# Altium project Computer_Board.PrjPcb (part 1 of 3)
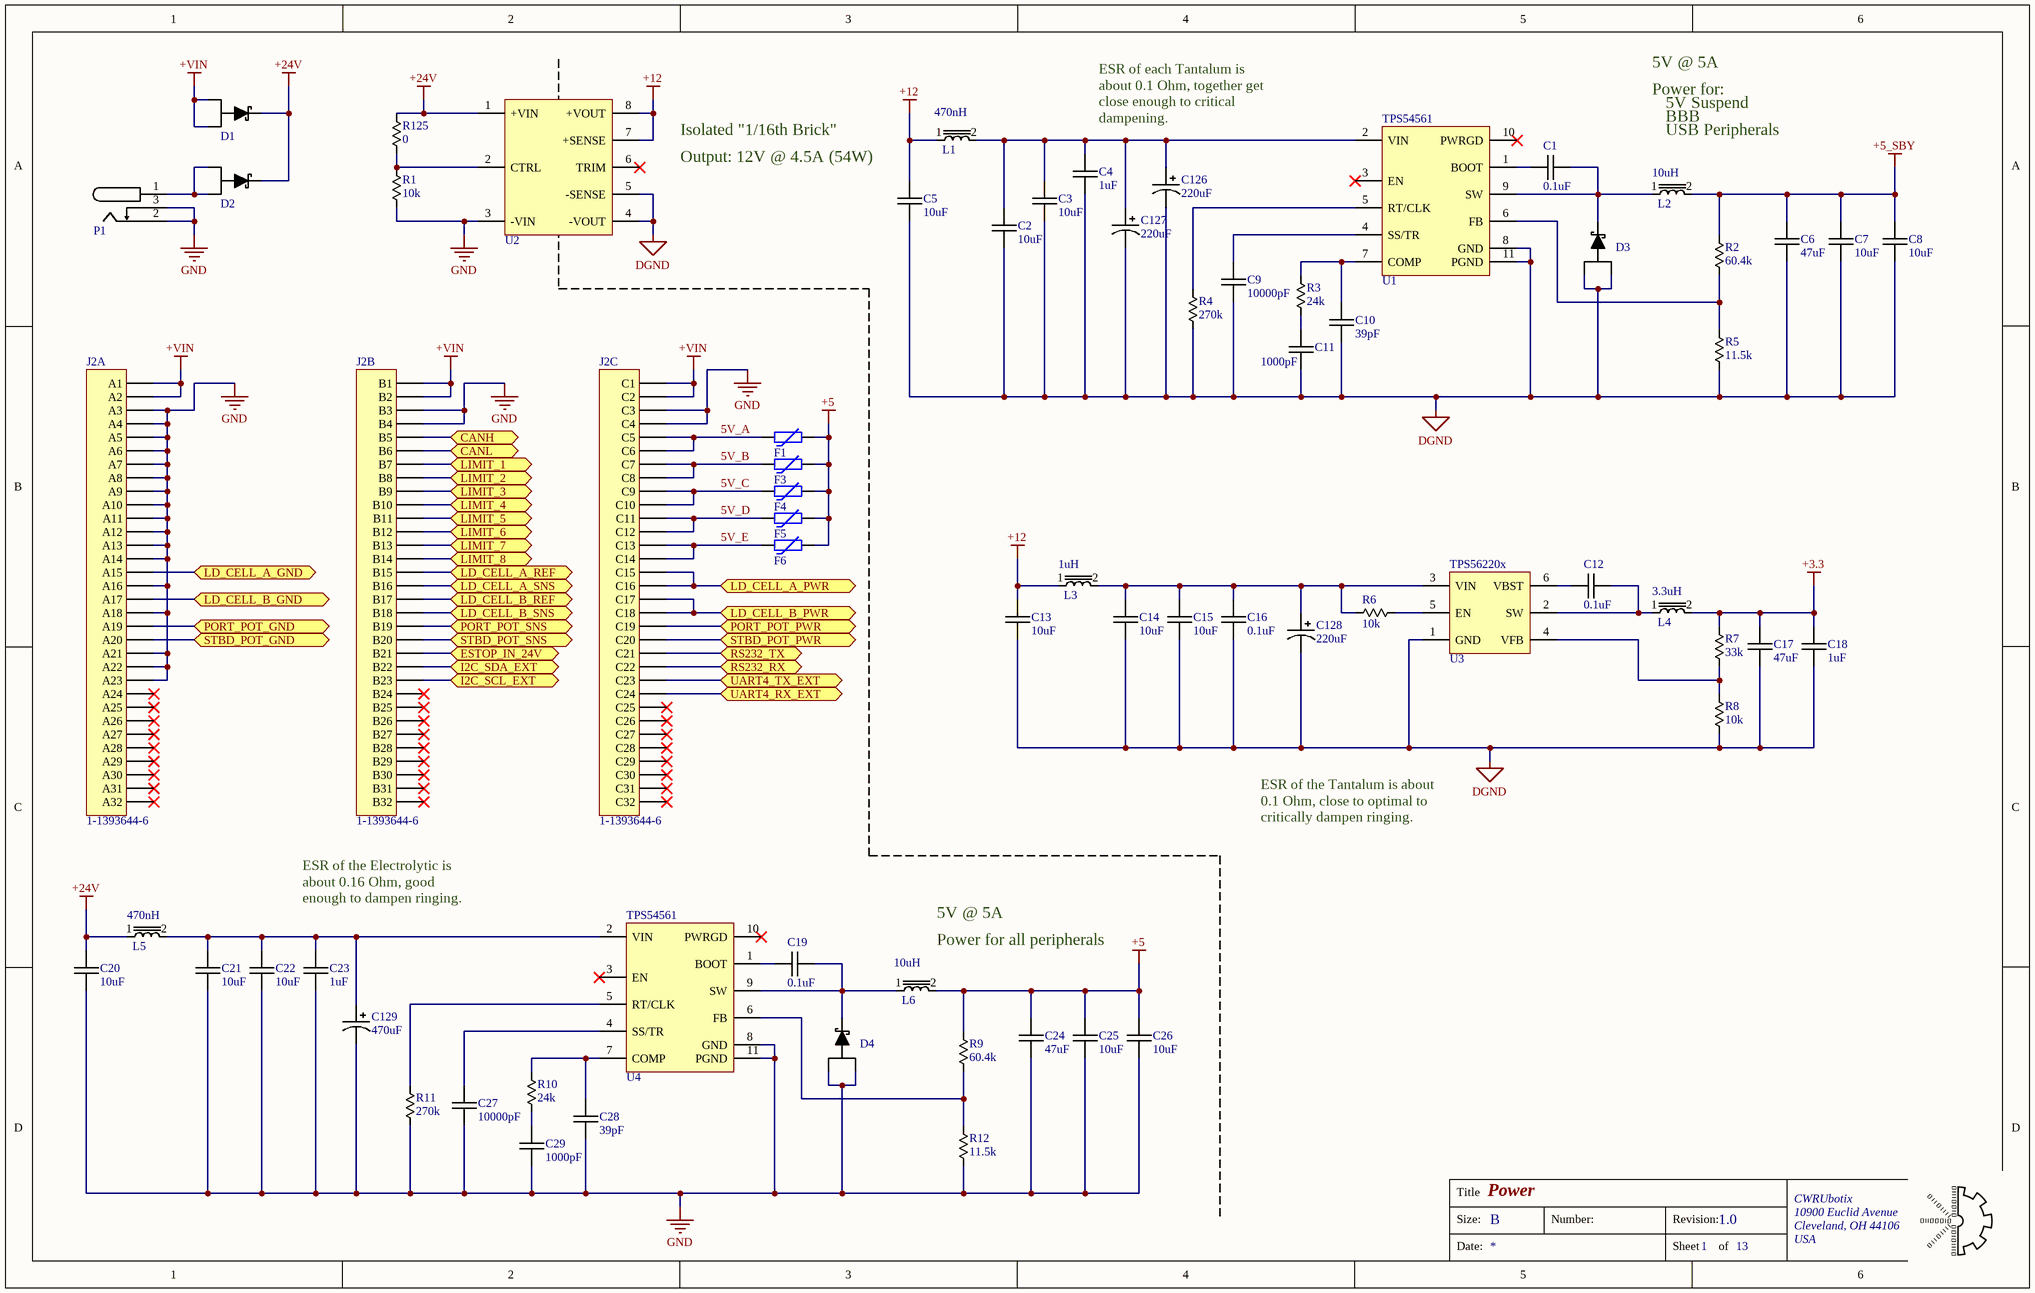
[diagram p0: SCH1_Power.SchDoc]
13 sheets, 443 parts. Net scope: flat (ports and power ports of the same name join across sheets).
Board file: Computer_Board.PcbDoc
Sheets:
  SCH1_Power.SchDoc
  SCH2_Main_Computer.SchDoc
  SCH3_Main_Computer_Eth.SchDoc
  SCH4_Main_Computer_USB.SchDoc
  SCH5_Main_computer_USB2-0.SchDoc
  SCH6_Main_computer_Display.SchDoc
  SCH7_Main_Computer_PCIe.SchDoc
  SCH8_BBB.SchDoc
  SCH9_BBB_Eth.SchDoc
  SCH10_BBB_USB.SchDoc
  SCH11_Digital_IO.SchDoc
  SCH12_AFE.SchDoc
  SCH13_RS232.SchDoc

## Sheet SCH1_Power.SchDoc: Power
size B; Organization: CWRUbotix; Address1: 10900 Euclid Avenue; Address2: Cleveland, OH 44106; Address3: USA; Revision: 1.0; SheetNumber: 1; SheetTotal: 13

### Parts
C1  0.1uF  [chip_0603]
C2  10uF  [chip_1206]
C3  10uF  [chip_1206]
C4  1uF  [chip_0805]
C5  10uF  [chip_1206]
C6  47uF  [chip_1210]
C7  10uF  [chip_1206]
C8  10uF  [chip_1206]
C9  10000pF  [chip_0603]
C10  39pF  [chip_0603]
C11  1000pF  [chip_0603]
C12  0.1uF  [chip_0603]
C13  10uF  [chip_1206]
C14  10uF  [chip_1206]
C15  10uF  [chip_1206]
C16  0.1uF  [chip_0603]
C17  47uF  [chip_1210]
C18  1uF  [chip_0805]
C19  0.1uF  [chip_0603]
C20  10uF  [chip_1206]
C21  10uF  [chip_1206]
C22  10uF  [chip_1206]
C23  1uF  [chip_0805]
C24  47uF  [chip_1210]
C25  10uF  [chip_1206]
C26  10uF  [chip_1206]
C27  10000pF  [chip_0603]
C28  39pF  [chip_0603]
C29  1000pF  [chip_0603]
C126  220uF  [chip_2917_KEMET_T495]
C127  220uF  [chip_2917_KEMET_T495]
C128  220uF  [chip_2917_KEMET_T495]
C129  470uF  [CAP_SMD_10x10_0]
D1  diode_sch_A12C3  [TO-277-3]  (value not drawn)
D2  diode_sch_A12C3  [TO-277-3]  (value not drawn)
D3  diode_sch_A12C3  [TO-277-3]  (value not drawn)
D4  diode_sch_A12C3  [TO-277-3]  (value not drawn)
F1  PTC_0  [chip_1206]  (value not drawn)
F3  PTC_0  [chip_1206]  (value not drawn)
F4  PTC_0  [chip_1206]  (value not drawn)
F5  PTC_0  [chip_1206]  (value not drawn)
F6  PTC_0  [chip_1206]  (value not drawn)
J2  1-1393644-6  [TE_CONN_1-1393644-6]  (parts A,B,C of 3)
L1  Inductance: 470nH  [CHIP_1008_IND]  (hidden comment: ind_1)
L2  Inductance: 10uH  [VISHAY_IHLP3232DZ]  (hidden comment: ind_1)
L3  Inductance: 1uH  [chip_0805]  (hidden comment: ind_1)
L4  Inductance: 3.3uH  [BOURNS_SRN5040]  (hidden comment: ind_1)
L5  Inductance: 470nH  [CHIP_1008_IND]  (hidden comment: ind_1)
L6  Inductance: 10uH  [VISHAY_IHLP3232DZ]  (hidden comment: ind_1)
P1  conn-barrel_0  [SWITCHCRAFT_RAPC722X]  (value not drawn)
R1  10k  [chip_0603]
R2  60.4k  [chip_0805]
R3  24k  [chip_0603]
R4  270k  [chip_0603]
R5  11.5k  [chip_0805]
R6  10k  [chip_0603]
R7  33k  [chip_0603]
R8  10k  [chip_0603]
R9  60.4k  [chip_0805]
R10  24k  [chip_0603]
R11  270k  [chip_0603]
R12  11.5k  [chip_0805]
R125  0  [chip_0805]
U1  TPS54561  [WSON-10_0]
U2  UWS-12/4.5-Q48N-C  [MURATA_UWS]  (value not drawn)
U3  TPS56220x  [sot-23-6]
U4  TPS54561  [WSON-10_0]

### Ports
CANH (bidir), CANL (bidir), ESTOP_IN_24V (bidir), I2C_SCL_EXT (bidir), I2C_SDA_EXT (bidir), LD_CELL_A_GND (bidir), LD_CELL_A_PWR (bidir), LD_CELL_A_REF (bidir), LD_CELL_A_SNS (bidir), LD_CELL_B_GND (bidir), LD_CELL_B_PWR (bidir), LD_CELL_B_REF (bidir), LD_CELL_B_SNS (bidir), LIMIT_1 (bidir), LIMIT_2 (bidir), LIMIT_3 (bidir), LIMIT_4 (bidir), LIMIT_5 (bidir), LIMIT_6 (bidir), LIMIT_7 (bidir), LIMIT_8 (bidir), PORT_POT_GND (bidir), PORT_POT_PWR (bidir), PORT_POT_SNS (bidir), RS232_RX (bidir), RS232_TX (bidir), STBD_POT_GND (bidir), STBD_POT_PWR (bidir), STBD_POT_SNS (bidir), UART4_RX_EXT (bidir), UART4_TX_EXT (bidir)

### Nets
+3.3: C17.1 C18.1 L4.2 R7.1
+5: C24.1 C25.1 C26.1 F1.2 F3.2 F4.2 F5.2 F6.2 L6.2 R9.1
+5_SBY: C6.1 C7.1 C8.1 L2.2 R2.1
+12: C5.1 C13.1 L1.1 L3.1 U2.7(+SENSE) U2.8(+VOUT)
+24V: C20.1 D1.3 D2.3 L5.1 R125.2 U2.1(+VIN)
+VIN: D1.1 D1.2 J2.A1 J2.A2 J2.B1 J2.B2 J2.C1 J2.C2
DGND: C2.2 C3.2 C4.2 C5.2 C6.2 C7.2 C8.2 C9.2 C10.2 C11.2 C13.2 C14.2 C15.2 C16.2 C17.2 C18.2 C126.2 C127.2 C128.2 D3.1 D3.2 R4.2 R5.2 R8.2 U1.8(GND) U1.11(PGND) U2.4(-VOUT) U2.5(-SENSE) U3.1(GND)
GND: C20.2 C21.2 C22.2 C23.2 C24.2 C25.2 C26.2 C27.2 C28.2 C29.2 C129.2 D4.1 D4.2 J2.A3 J2.A4 J2.A5 J2.A6 J2.A7 J2.A8 J2.A9 J2.A10 J2.A11 J2.A12 J2.A13 J2.A14 J2.A16 J2.A18 J2.A21 J2.A22 J2.A23 J2.B3 J2.B4 J2.C3 J2.C4 P1.2(GND) P1.3 R1.2 R11.2 R12.2 U2.3(-VIN) U4.8(GND) U4.11(PGND)
5V_A: F1.1 J2.C5 J2.C6
5V_B: F3.1 J2.C7 J2.C8
5V_C: F4.1 J2.C9 J2.C10
5V_D: F5.1 J2.C11 J2.C12
5V_E: F6.1 J2.C13 J2.C14
CANH: J2.B5 ; port CANH
CANL: J2.B6 ; port CANL
ESTOP_IN_24V: J2.B21 ; port ESTOP_IN_24V
I2C_SCL_EXT: J2.B23 ; port I2C_SCL_EXT
I2C_SDA_EXT: J2.B22 ; port I2C_SDA_EXT
LD_CELL_A_GND: J2.A15 ; port LD_CELL_A_GND
LD_CELL_A_PWR: J2.C15 J2.C16 ; port LD_CELL_A_PWR
LD_CELL_A_REF: J2.B15 ; port LD_CELL_A_REF
LD_CELL_A_SNS: J2.B16 ; port LD_CELL_A_SNS
LD_CELL_B_GND: J2.A17 ; port LD_CELL_B_GND
LD_CELL_B_PWR: J2.C17 J2.C18 ; port LD_CELL_B_PWR
LD_CELL_B_REF: J2.B17 ; port LD_CELL_B_REF
LD_CELL_B_SNS: J2.B18 ; port LD_CELL_B_SNS
LIMIT_1: J2.B7 ; port LIMIT_1
LIMIT_2: J2.B8 ; port LIMIT_2
LIMIT_3: J2.B9 ; port LIMIT_3
LIMIT_4: J2.B10 ; port LIMIT_4
LIMIT_5: J2.B11 ; port LIMIT_5
LIMIT_6: J2.B12 ; port LIMIT_6
LIMIT_7: J2.B13 ; port LIMIT_7
LIMIT_8: J2.B14 ; port LIMIT_8
PORT_POT_GND: J2.A19 ; port PORT_POT_GND
PORT_POT_PWR: J2.C19 ; port PORT_POT_PWR
PORT_POT_SNS: J2.B19 ; port PORT_POT_SNS
RS232_RX: J2.C22 ; port RS232_RX
RS232_TX: J2.C21 ; port RS232_TX
STBD_POT_GND: J2.A20 ; port STBD_POT_GND
STBD_POT_PWR: J2.C20 ; port STBD_POT_PWR
STBD_POT_SNS: J2.B20 ; port STBD_POT_SNS
UART4_RX_EXT: J2.C24 ; port UART4_RX_EXT
UART4_TX_EXT: J2.C23 ; port UART4_TX_EXT
NetC1_1: C1.1 U1.1(BOOT)
NetC1_2: C1.2 D3.3 L2.1 U1.9(SW)
NetC2_1: C2.1 C3.1 C4.1 C126.1 C127.1 L1.2 U1.2(VIN)
NetC9_1: C9.1 U1.4(SS/TR)
NetC10_1: C10.1 R3.1 U1.7(COMP)
NetC11_1: C11.1 R3.2
NetC12_1: C12.1 U3.6(VBST)
NetC12_2: C12.2 L4.1 U3.2(SW)
NetC14_1: C14.1 C15.1 C16.1 C128.1 L3.2 R6.2 U3.3(VIN)
NetC19_1: C19.1 U4.1(BOOT)
NetC19_2: C19.2 D4.3 L6.1 U4.9(SW)
NetC21_1: C21.1 C22.1 C23.1 C129.1 L5.2 U4.2(VIN)
NetC27_1: C27.1 U4.4(SS/TR)
NetC28_1: C28.1 R10.1 U4.7(COMP)
NetC29_1: C29.1 R10.2
NetD2_1: D2.1 D2.2 P1.1(VCC)
NetR1_1: R1.1 R125.1 U2.2(CTRL)
NetR2_2: R2.2 R5.1 U1.6(FB)
NetR4_1: R4.1 U1.5(RT/CLK)
NetR6_1: R6.1 U3.5(EN)
NetR7_2: R7.2 R8.1 U3.4(VFB)
NetR9_2: R9.2 R12.1 U4.6(FB)
NetR11_1: R11.1 U4.5(RT/CLK)

Not connected (* = marked no-connect by the designer): J2 A24* A25* A26* A27* A28* A29* A30* A31* A32* B24* B25* B26* B27* B28* B29* B30* B31* B32* C25* C26* C27* C28* C29* C30* C31* C32*; U1 3(EN)* 10(PWRGD)*; U2 6(TRIM)*; U4 3(EN)* 10(PWRGD)*

### Notes on the sheet
- 5V @ 5A
- Power for:
- Isolated "1/16th Brick"
- (near C5) Output: 12V @ 4.5A (54W)
- ESR of each Tantalum is about 0.1 Ohm, together get close enough to critical dampening.
- 5V Suspend
- BBB
- USB Peripherals
- ESR of the Tantalum is about 0.1 Ohm, close to optimal to critically dampen ringing.
- ESR of the Electrolytic is about 0.16 Ohm, good enough to dampen ringing.
- (near L6) Power for all peripherals
- Title
- Size:
- B
- Number:
- Revision:
- Date:
- Sheet
- of

### Library data of the parts
C1 C12 C16 C19 = CAP-00542: CAP, 0.1uF, ±10%, 16V, X7R, 0603; Manufacturer: Murata; Part Number: CAP-00542; Capacitance: 0.1uF; Tolerance: ±10%; Voltage Rating: 16V; Type: X7R
C2 C3 C5 C7 C8 C13-C15 C20-C22 C25 C26 = CAP-00539: CAP, 10uF, ±10%, 25V, X7R, 1206; Manufacturer: Samsung; Manufacturer PN: CL31B106KAHNNNE; Part Number: CAP-00539; Capacitance: 10uF; Tolerance: ±10%; Voltage Rating: 25V; Type: X7R
C4 C18 C23 = CAP-00110: CAP, 1uF, 10%, 16V, X7R, 0805; Manufacturer: Murata; Manufacturer PN: GRM21BR71C105KA01K; Part Number: CAP-00110; Capacitance: 1uF; Tolerance: 10%; Voltage Rating: 16V; Type: X7R
C6 C17 C24 = CAP-00557: CAP, 47uF, ±20%, 6.3V, X7R, 1210; Manufacturer: KEMET; Manufacturer PN: C1210C476M9RACTU; Part Number: CAP-00557; Capacitance: 47uF; Tolerance: ±20%; Voltage Rating: 6.3V; Type: X7R; Cost: $1.08
C9 C27 = CAP-00543: CAP, 10000pF, ±10%, 16V, X7R, 0603; Part Number: CAP-00543; Capacitance: 10000pF; Tolerance: ±10%; Voltage Rating: 16V; Type: X7R
C10 C28 = CAP-00423: CAP, 39pF, ±1%, 50V, C0G, 0603; Manufacturer: Murata; Manufacturer PN: GRM1885C1H390FA01D; Part Number: CAP-00423; Capacitance: 39pF; Tolerance: ±1%; Voltage Rating: 50V; Type: C0G
C11 C29 = CAP-00457: CAP, 1000pF, ±1%, 50V, C0G, 0603; Manufacturer: Murata; Manufacturer PN: GRM1885C1H102FA01D; Part Number: CAP-00457; Capacitance: 1000pF; Tolerance: ±1%; Voltage Rating: 50V; Type: C0G
C126-C128 = CAP-00584: CAP, 220uF, ±10%, 16V, Tantalum, 100mOhm, 2917; Manufacturer: KEMET; Manufacturer PN: T495X227K016ATE100; Part Number: CAP-00584; Capacitance: 220uF; Tolerance: ±10%; Voltage Rating: 16V; Type: Tantalum; Cost: $2.57
C129 = CAP-00558: CAP, 470uF, ±20%, 25V, Al, SMD, 7000hrs at 105°C; Manufacturer: Nichicon; Manufacturer PN: UCW1E471MNL1GS; Part Number: CAP-00558; Capacitance: 470uF; Tolerance: ±20%; Voltage Rating: 25V; Type: Al; Cost: $0.70
D1-D4 = DIO-00074: Dio, Schottky, 5A, 0.63V, 60V, TO-227; Manufacturer: Vishay; Manufacturer PN: SS5P6-M3/86A; Part Number: DIO-00074; Forward Voltage: 0.63V; Reverse Breakdown Voltage: 60V; Current Rating: 5A; Type: Schottky; Cost: 0.6
F1 F3-F6 = MISC-00008: PTC Resettable fuse, 6V, 500mA, 1206; Manufacturer: Eaton; Manufacturer PN: PTS12066V050; Part Number: MISC-00008; Cost: 0.3
J2 = CONN-00084: DIN 41612 Plug, 96-Pos, Male Pins, Right-Angle; Manufacturer: TE Connectivity; Positions per level: 32; Levels: 3; Part Number: CONN-00084; Type: Plug; Manufacturer PN: 1-1393644-6; Cost: 7.49
L1 L5 = MAG-00124: Ind, 470nH, 4A, 0.027 Ohm, 1008; Manufacturer: Murata; Manufacturer PN: DFE252012P-R47M=P2; Tolerance: 20%; Test Freq: 1MHz; DCR: 27mOhm; Part Number: MAG-00124; Current Rating: 4A; Cost: 0.51
L2 L6 = MAG-00106: Ind, 10uH, 20%, 5.2A (9A sat.), 0.0599 Ohm; Manufacturer: Vishay Dale; Manufacturer PN: IHLP3232DZER100M01; DCR: 59.9mOhm; Part Number: MAG-00106; Tolerance: 20%; Current Rating: 5.2A; Cost: 1.65
L3 = MAG-00019: Ind, 1uH, 20%, 900mA, 0805; Manufacturer: TDK; Manufacturer PN: MLZ2012A1R0WTD25; DCR: 130 mOhm; Part Number: MAG-00019; Tolerance: 20%; Current Rating: 900mA
L4 = MAG-00111: Ind, 3.3uH, 3.3A (3.8A sat.), 0.027 Ohm; Manufacturer: Bourns; Manufacturer PN: SRN5040-3R3M; Tolerance: 20%; DCR: 27mOhm; Part Number: MAG-00111; Current Rating: 3.3A; Cost: 0.46
P1 = CONN-00074: Barrel Jack, 2.0x5.5mm IDxOD, Right-Angle; Manufacturer: Switchcraft; Manufacturer PN: RAPC722X; Positions per level: 3; Levels: 1; Part Number: CONN-00074; Type: Barrel Jack; Cost: 1.64
R1 R6 R8 = RES-00306: RES SMD 10K OHM 1% 1/4W 0603; Manufacturer: Panasonic; Manufacturer PN: ERJ-PA3F1002V; Power Rating: 0.25W; Part Number: RES-00306; Resistance: 10k; Tolerance: 1%; Cost: 0.144
R2 R9 = RES-00531: RES SMD 60.4K OHM 1% 1/8W 0805; Manufacturer: Rohm Semiconductor; Manufacturer PN: KTR10EZPF6042; Power Rating: 0.125W; Part Number: RES-00531; Resistance: 60.4k; Tolerance: 1%
R3 R10 = RES-00399: RES SMD 24K OHM 1% 1/4W 0603; Manufacturer: Panasonic; Manufacturer PN: ERJ-PA3F2402V; Power Rating: 0.25W; Part Number: RES-00399; Resistance: 24k; Tolerance: 1%
R4 R11 = RES-00405: RES SMD 270K OHM 1% 1/4W 0603; Manufacturer: Panasonic; Manufacturer PN: ERJ-PA3F2703V; Power Rating: 0.25W; Part Number: RES-00405; Resistance: 270k; Tolerance: 1%
R5 R12 = RES-00309: RES SMD 11.5K OHM 1% 1/8W 0805; Manufacturer: Rohm Semiconductor; Manufacturer PN: KTR10EZPF1152; Power Rating: 0.125W; Part Number: RES-00309; Resistance: 11.5k; Tolerance: 1%
R7 = RES-00442: RES SMD 33K OHM 1% 1/4W 0603; Manufacturer: Panasonic; Manufacturer PN: ERJ-PA3F3302V; Power Rating: 0.25W; Part Number: RES-00442; Resistance: 33k; Tolerance: 1%
R125 = RES-00720: RES SMD 0 OHM 1/8W 0805 Thick Film; Manufacturer: Stackpole; Manufacturer PN: RMCF0805ZT0R00; Tolerance: Jumper; Part Number: RES-00720; Resistance: 0; Power Rating: 1/8W; Cost: 0.1
U1 U4 = PWREG-00033: REG, SW Buck Adj, 5A, 4.5-60V, 2.5MHz, TPS54561; Manufacturer: TI; Manufacturer PN: TPS54561DPRR; Voltage Range Out: 0.8-58.8V; Frequency: 100kHz-2.5MHz; Reg Type: SW Buck; Part Number: PWREG-00033; Voltage Range In: 4.5-60V; Max Current: 5A; Fixed/Adj: Adj; Cost: 5.52
U2 = PWREG-00058: Module, Isolated, 1/16 Brick, 12V 4.5A (54W) Negative Logic; Manufacturer: Murata; Voltage Range In: 18 ~ 75V; Reg Type: Isolated Module; Fixed/Adj: Fixed; Part Number: PWREG-00058; Voltage Range Out: 12V; Max Current: 4.5A; Manufacturer PN: UWS-12/4.5-Q48N-C; Cost: 32
U3 = PWREG-00040: REG, Synchronous Buck, 2A, 4.5-17V Input, SOT-23-6, TPS562201; Manufacturer: TI; Manufacturer PN: TPS562201DDCR; Voltage Range Out: 0.76 - 7V; Frequency: 580kHz; Reg Type: SW Buck; Fixed/Adj: Adj; Part Number: PWREG-00040; Voltage Range In: 4.5 - 17V; Max Current: 2A; Cost: 0.68

## Sheet SCH2_Main_Computer.SchDoc: Main Computer
size B; Organization: CWRUbotix; Address1: 10900 Euclid Avenue; Address2: Cleveland, OH 44106; Address3: USA; Revision: 1.0; SheetNumber: 2; SheetTotal: 13
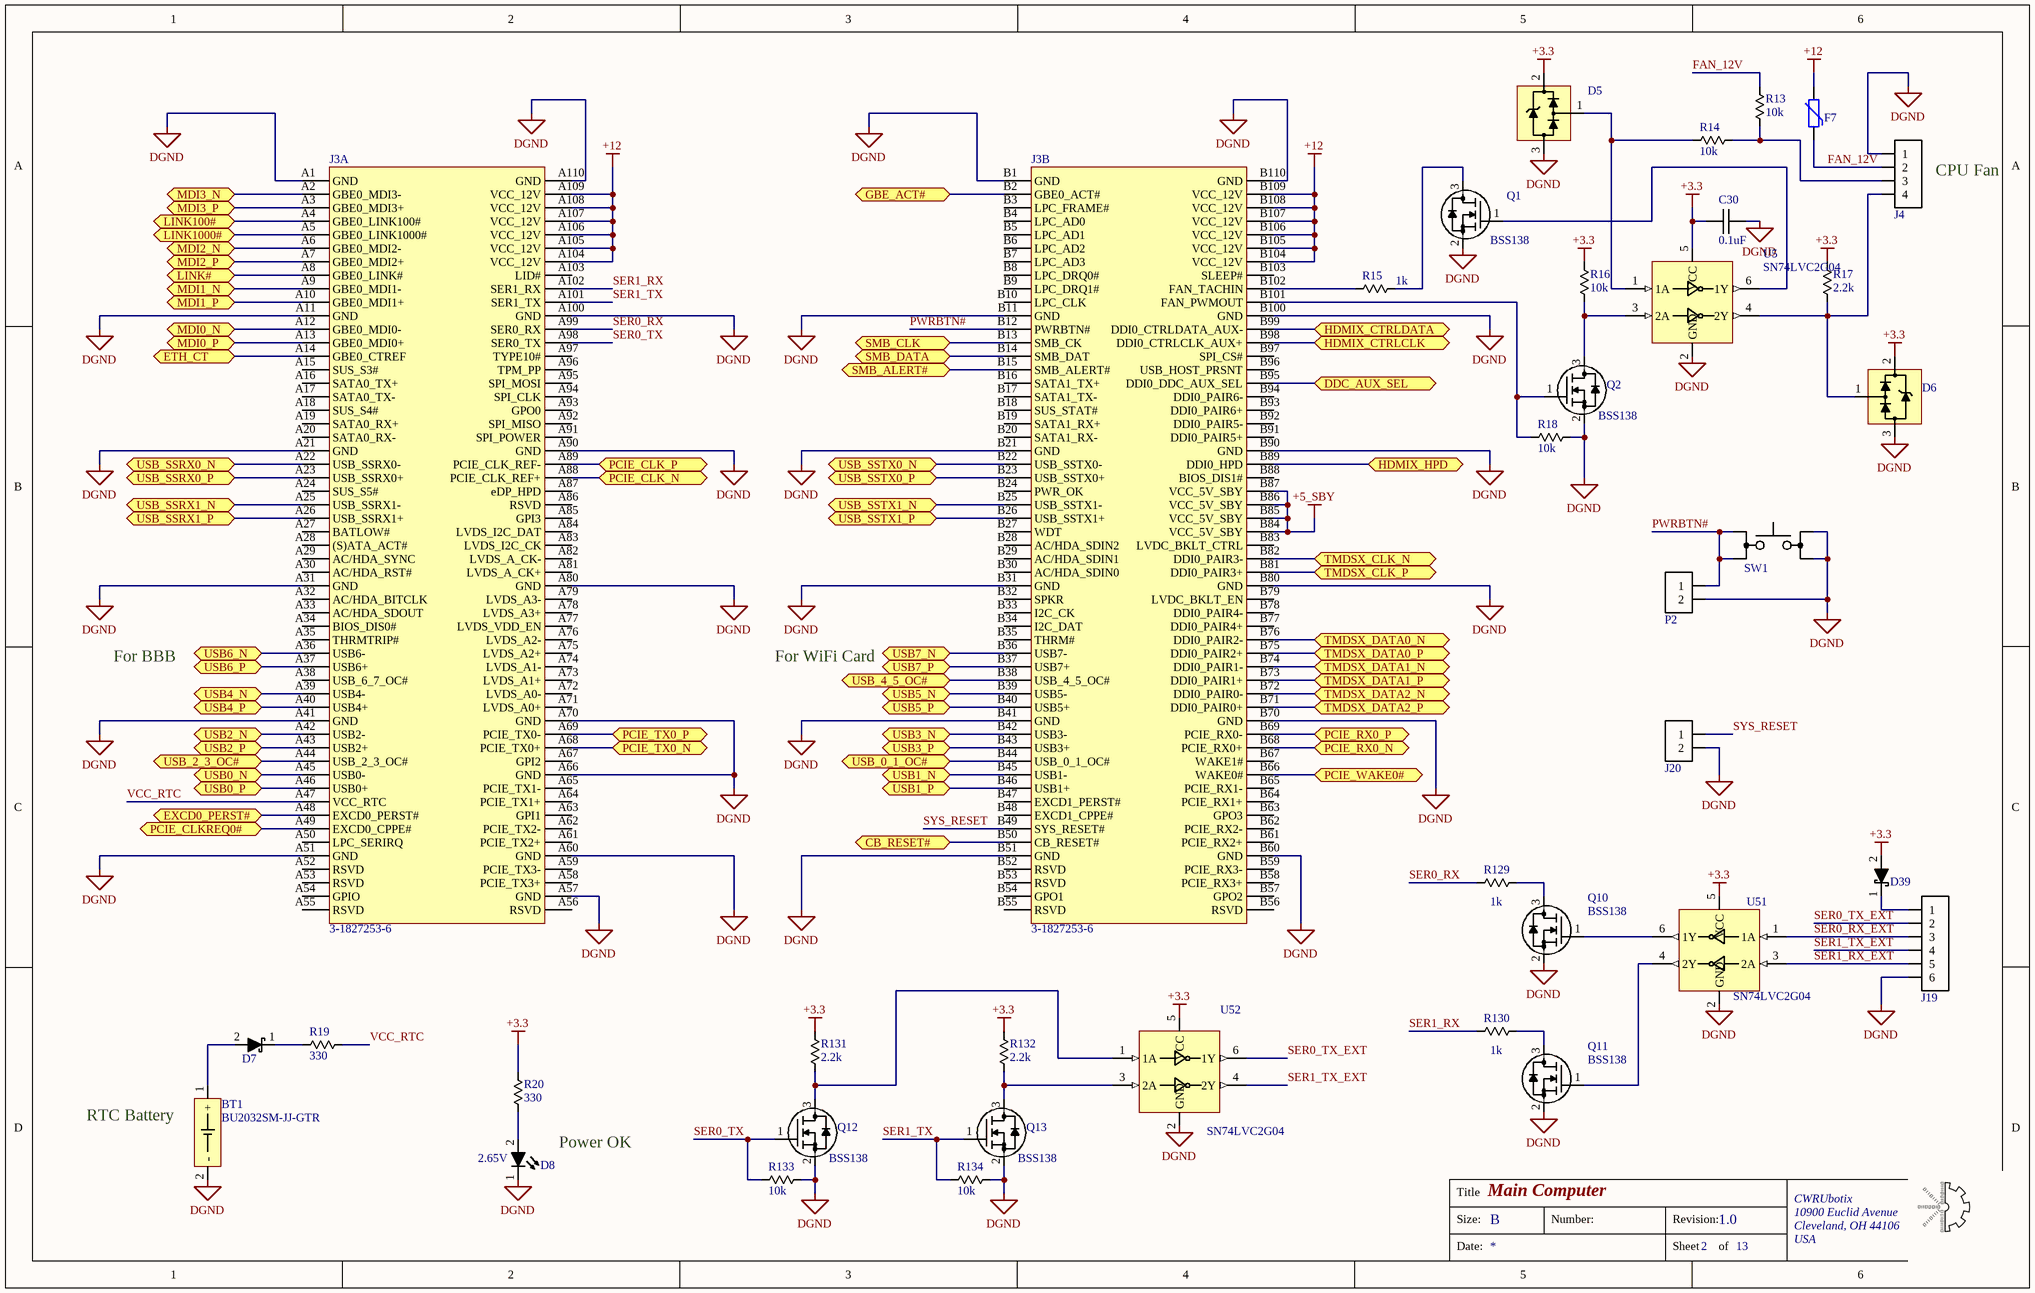
[diagram p1: SCH2_Main_Computer.SchDoc]

### Parts
BT1  BU2032SM-JJ-GTR  [BU2032SM-JJ-GTR]
C30  0.1uF  [chip_0603]
D5  DLPT05  [sot-23-3]  (value not drawn)
D6  DLPT05  [sot-23-3]  (value not drawn)
D7  diode_2  [sod123_0]  (value not drawn)
D8  Forward Voltage: 2.65V  [chip_0603_LED]  (hidden comment: diode_4)
D39  diode_2  [sod123_0]  (value not drawn)
F7  PTC_0  [chip_1210]  (value not drawn)
J3  3-1827253-6  [TE_CONN_1827253]  (parts A,B of 2)
J4  conn-4x1_0  [MOLEX_0470531000]  (value not drawn)
J19  conn-6x1_0  [HDDR_6X1_0]  (value not drawn)
J20  conn-2x1_0  [HDDR_2x1_0]  (value not drawn)
P2  conn-2x1_0  [HDDR_2x1_0]  (value not drawn)
Q1  Manufacturer PN: BSS138  [sot-23-3]  (hidden comment: n-mosfet_1)
Q2  Manufacturer PN: BSS138  [sot-23-3]  (hidden comment: n-mosfet_1)
Q10  Manufacturer PN: BSS138  [sot-23-3]  (hidden comment: n-mosfet_1)
Q11  Manufacturer PN: BSS138  [sot-23-3]  (hidden comment: n-mosfet_1)
Q12  Manufacturer PN: BSS138  [sot-23-3]  (hidden comment: n-mosfet_1)
Q13  Manufacturer PN: BSS138  [sot-23-3]  (hidden comment: n-mosfet_1)
R13  10k  [chip_0603]
R14  10k  [chip_0603]
R15  1k  [chip_0603]
R16  10k  [chip_0603]
R17  2.2k  [chip_0603]
R18  10k  [chip_0603]
R19  330  [chip_0603]
R20  330  [chip_0603]
R129  1k  [chip_0603]
R130  1k  [chip_0603]
R131  2.2k  [chip_0603]
R132  2.2k  [chip_0603]
R133  10k  [chip_0603]
R134  10k  [chip_0603]
SW1  SW_1P1T_2  [B3FS-1000]  (value not drawn)
U5  SN74LVC2G04  [sot-23-6]
U51  SN74LVC2G04  [sot-23-6]
U52  SN74LVC2G04  [sot-23-6]

### Ports
CB_RESET# (bidir), DDC_AUX_SEL (bidir), ETH_CT (bidir), EXCD0_PERST# (bidir), GBE_ACT# (bidir), HDMIX_CTRLCLK (bidir), HDMIX_CTRLDATA (bidir), HDMIX_HPD (bidir), LINK100# (bidir), LINK1000# (bidir), LINK# (bidir), MDI0_N (bidir), MDI0_P (bidir), MDI1_N (bidir), MDI1_P (bidir), MDI2_N (bidir), MDI2_P (bidir), MDI3_N (bidir), MDI3_P (bidir), PCIE_CLK_N (bidir), PCIE_CLK_P (bidir), PCIE_CLKREQ0# (bidir), PCIE_RX0_N (bidir), PCIE_RX0_P (bidir), PCIE_TX0_N (bidir), PCIE_TX0_P (bidir), PCIE_WAKE0# (bidir), SMB_ALERT# (bidir), SMB_CLK (bidir), SMB_DATA (bidir), TMDSX_CLK_N (bidir), TMDSX_CLK_P (bidir), TMDSX_DATA0_N (bidir), TMDSX_DATA0_P (bidir), TMDSX_DATA1_N (bidir), TMDSX_DATA1_P (bidir), TMDSX_DATA2_N (bidir), TMDSX_DATA2_P (bidir), USB0_N (bidir), USB0_P (bidir), USB1_N (bidir), USB1_P (bidir), USB2_N (bidir), USB2_P (bidir), USB3_N (bidir), USB3_P (bidir), USB4_N (bidir), USB4_P (bidir), USB5_N (bidir), USB5_P (bidir), USB6_N (bidir), USB6_P (bidir), USB7_N (bidir), USB7_P (bidir), USB_0_1_OC# (bidir), USB_2_3_OC# (bidir), USB_4_5_OC# (bidir), USB_SSRX0_N (bidir), USB_SSRX0_P (bidir), USB_SSRX1_N (bidir), USB_SSRX1_P (bidir), USB_SSTX0_N (bidir), USB_SSTX0_P (bidir), USB_SSTX1_N (bidir), USB_SSTX1_P (bidir)

### Nets
+3.3: C30.1 D5.2(VCC) D6.2(VCC) D39.2 R16.1 R17.1 R20.2 R131.1 R132.1 U5.5(VCC) U51.5(VCC) U52.5(VCC)
+5_SBY: J3.B84(VCC_5V_SBY) J3.B85(VCC_5V_SBY) J3.B86(VCC_5V_SBY) J3.B87(VCC_5V_SBY)
+12: F7.2 J3.A104(VCC_12V) J3.A105(VCC_12V) J3.A106(VCC_12V) J3.A107(VCC_12V) J3.A108(VCC_12V) J3.A109(VCC_12V) J3.B104(VCC_12V) J3.B105(VCC_12V) J3.B106(VCC_12V) J3.B107(VCC_12V) J3.B108(VCC_12V) J3.B109(VCC_12V)
DGND: BT1.2(-) C30.2 D5.3(GND) D6.3(GND) D8.1 J3.A1(GND) J3.A11(GND) J3.A21(GND) J3.A31(GND) J3.A41(GND) J3.A51(GND) J3.A57(GND) J3.A60(GND) J3.A66(GND) J3.A70(GND) J3.A80(GND) J3.A90(GND) J3.A100(GND) J3.A110(GND) J3.B1(GND) J3.B11(GND) J3.B21(GND) J3.B31(GND) J3.B41(GND) J3.B51(GND) J3.B60(GND) J3.B70(GND) J3.B80(GND) J3.B90(GND) J3.B100(GND) J3.B110(GND) J4.1 J19.6 J20.2 P2.2 Q1.2(S) Q2.2(S) Q10.2(S) Q11.2(S) Q12.2(S) Q13.2(S) R18.2 R133.2 R134.2 SW1.3 SW1.4 U5.2(GND) U51.2(GND) U52.2(GND)
CB_RESET#: J3.B50(CB_RESET#) ; port CB_RESET#
DDC_AUX_SEL: J3.B95(DDI0_DDC_AUX_SEL) ; port DDC_AUX_SEL
ETH_CT: J3.A14(GBE0_CTREF) ; port ETH_CT
EXCD0_PERST#: J3.A48(EXCD0_PERST#) ; port EXCD0_PERST#
FAN_12V: F7.1 J4.2 R13.2
GBE_ACT#: J3.B2(GBE0_ACT#) ; port GBE_ACT#
HDMIX_CTRLCLK: J3.B98(DDI0_CTRLCLK_AUX+) ; port HDMIX_CTRLCLK
HDMIX_CTRLDATA: J3.B99(DDI0_CTRLDATA_AUX-) ; port HDMIX_CTRLDATA
HDMIX_HPD: J3.B89(DDI0_HPD) ; port HDMIX_HPD
LINK100#: J3.A4(GBE0_LINK100#) ; port LINK100#
LINK1000#: J3.A5(GBE0_LINK1000#) ; port LINK1000#
LINK#: J3.A8(GBE0_LINK#) ; port LINK#
MDI0_N: J3.A12(GBE0_MDI0-) ; port MDI0_N
MDI0_P: J3.A13(GBE0_MDI0+) ; port MDI0_P
MDI1_N: J3.A9(GBE0_MDI1-) ; port MDI1_N
MDI1_P: J3.A10(GBE0_MDI1+) ; port MDI1_P
MDI2_N: J3.A6(GBE0_MDI2-) ; port MDI2_N
MDI2_P: J3.A7(GBE0_MDI2+) ; port MDI2_P
MDI3_N: J3.A2(GBE0_MDI3-) ; port MDI3_N
MDI3_P: J3.A3(GBE0_MDI3+) ; port MDI3_P
PCIE_CLK_N: J3.A88(PCIE_CLK_REF+) ; port PCIE_CLK_N
PCIE_CLK_P: J3.A89(PCIE_CLK_REF-) ; port PCIE_CLK_P
PCIE_CLKREQ0#: J3.A49(EXCD0_CPPE#) ; port PCIE_CLKREQ0#
PCIE_RX0_N: J3.B68(PCIE_RX0+) ; port PCIE_RX0_N
PCIE_RX0_P: J3.B69(PCIE_RX0-) ; port PCIE_RX0_P
PCIE_TX0_N: J3.A68(PCIE_TX0+) ; port PCIE_TX0_N
PCIE_TX0_P: J3.A69(PCIE_TX0-) ; port PCIE_TX0_P
PCIE_WAKE0#: J3.B66(WAKE0#) ; port PCIE_WAKE0#
PWRBTN#: J3.B12(PWRBTN#) P2.1 SW1.1 SW1.2
SER0_RX: J3.A99(SER0_RX) R129.1
SER0_RX_EXT: J19.3 U51.1(1A)
SER0_TX: J3.A98(SER0_TX) Q12.1(G) R133.1
SER0_TX_EXT: J19.2 U52.6(1Y)
SER1_RX: J3.A102(SER1_RX) R130.1
SER1_RX_EXT: J19.5 U51.3(2A)
SER1_TX: J3.A101(SER1_TX) Q13.1(G) R134.1
SER1_TX_EXT: J19.4 U52.4(2Y)
SMB_ALERT#: J3.B15(SMB_ALERT#) ; port SMB_ALERT#
SMB_CLK: J3.B13(SMB_CK) ; port SMB_CLK
SMB_DATA: J3.B14(SMB_DAT) ; port SMB_DATA
SYS_RESET: J3.B49(SYS_RESET#) J20.1
TMDSX_CLK_N: J3.B82(DDI0_PAIR3-) ; port TMDSX_CLK_N
TMDSX_CLK_P: J3.B81(DDI0_PAIR3+) ; port TMDSX_CLK_P
TMDSX_DATA0_N: J3.B76(DDI0_PAIR2-) ; port TMDSX_DATA0_N
TMDSX_DATA0_P: J3.B75(DDI0_PAIR2+) ; port TMDSX_DATA0_P
TMDSX_DATA1_N: J3.B74(DDI0_PAIR1-) ; port TMDSX_DATA1_N
TMDSX_DATA1_P: J3.B73(DDI0_PAIR1+) ; port TMDSX_DATA1_P
TMDSX_DATA2_N: J3.B72(DDI0_PAIR0-) ; port TMDSX_DATA2_N
TMDSX_DATA2_P: J3.B71(DDI0_PAIR0+) ; port TMDSX_DATA2_P
USB0_N: J3.A45(USB0-) ; port USB0_N
USB0_P: J3.A46(USB0+) ; port USB0_P
USB1_N: J3.B45(USB1-) ; port USB1_N
USB1_P: J3.B46(USB1+) ; port USB1_P
USB2_N: J3.A42(USB2-) ; port USB2_N
USB2_P: J3.A43(USB2+) ; port USB2_P
USB3_N: J3.B42(USB3-) ; port USB3_N
USB3_P: J3.B43(USB3+) ; port USB3_P
USB4_N: J3.A39(USB4-) ; port USB4_N
USB4_P: J3.A40(USB4+) ; port USB4_P
USB5_N: J3.B39(USB5-) ; port USB5_N
USB5_P: J3.B40(USB5+) ; port USB5_P
USB6_N: J3.A36(USB6-) ; port USB6_N
USB6_P: J3.A37(USB6+) ; port USB6_P
USB7_N: J3.B36(USB7-) ; port USB7_N
USB7_P: J3.B37(USB7+) ; port USB7_P
USB_0_1_OC#: J3.B44(USB_0_1_OC#) ; port USB_0_1_OC#
USB_2_3_OC#: J3.A44(USB_2_3_OC#) ; port USB_2_3_OC#
USB_4_5_OC#: J3.B38(USB_4_5_OC#) ; port USB_4_5_OC#
USB_SSRX0_N: J3.A22(USB_SSRX0-) ; port USB_SSRX0_N
USB_SSRX0_P: J3.A23(USB_SSRX0+) ; port USB_SSRX0_P
USB_SSRX1_N: J3.A25(USB_SSRX1-) ; port USB_SSRX1_N
USB_SSRX1_P: J3.A26(USB_SSRX1+) ; port USB_SSRX1_P
USB_SSTX0_N: J3.B22(USB_SSTX0-) ; port USB_SSTX0_N
USB_SSTX0_P: J3.B23(USB_SSTX0+) ; port USB_SSTX0_P
USB_SSTX1_N: J3.B25(USB_SSTX1-) ; port USB_SSTX1_N
USB_SSTX1_P: J3.B26(USB_SSTX1+) ; port USB_SSTX1_P
VCC_RTC: J3.A47(VCC_RTC) R19.2
NetBT1_1: BT1.1(+) D7.2
NetD5_1: D5.1(LINE) R14.1 U5.1(1A)
NetD6_1: D6.1(LINE) J4.4 R17.2 U5.4(2Y)
NetD7_1: D7.1 R19.1
NetD8_2: D8.2 R20.1
NetD39_1: D39.1 J19.1
NetJ3_B101: J3.B101(FAN_PWMOUT) Q2.1(G) R18.1
NetJ3_B102: J3.B102(FAN_TACHIN) R15.1
NetJ4_3: J4.3 R13.1 R14.2
NetQ1_1: Q1.1(G) U5.6(1Y)
NetQ1_3: Q1.3(D) R15.2
NetQ2_3: Q2.3(D) R16.2 U5.3(2A)
NetQ10_1: Q10.1(G) U51.6(1Y)
NetQ10_3: Q10.3(D) R129.2
NetQ11_1: Q11.1(G) U51.4(2Y)
NetQ11_3: Q11.3(D) R130.2
NetQ12_3: Q12.3(D) R131.2 U52.1(1A)
NetQ13_3: Q13.3(D) R132.2 U52.3(2A)

Not connected (* = marked no-connect by the designer): J3 A15(SUS_S3#) A16(SATA0_TX+) A17(SATA0_TX-) A18(SUS_S4#) A19(SATA0_RX+) A20(SATA0_RX-) A24(SUS_S5#) A27(BATLOW#) A28((S)ATA_ACT#) A29(AC/HDA_SYNC) A30(AC/HDA_RST#) A32(AC/HDA_BITCLK) A33(AC/HDA_SDOUT) A34(BIOS_DIS0#) A35(THRMTRIP#) A38(USB_6_7_OC#) A50(LPC_SERIRQ) A52(RSVD) A53(RSVD) A54(GPIO) A55(RSVD) A56(RSVD) A58(PCIE_TX3+) A59(PCIE_TX3-) A61(PCIE_TX2+) A62(PCIE_TX2-) A63(GPI1) A64(PCIE_TX1+) A65(PCIE_TX1-) A67(GPI2) A71(LVDS_A0+) A72(LVDS_A0-) A73(LVDS_A1+) A74(LVDS_A1-) A75(LVDS_A2+) A76(LVDS_A2-) A77(LVDS_VDD_EN) A78(LVDS_A3+) A79(LVDS_A3-) A81(LVDS_A_CK+) A82(LVDS_A_CK-) A83(LVDS_I2C_CK) A84(LVDS_I2C_DAT) A85(GPI3) A86(RSVD) A87(eDP_HPD) A91(SPI_POWER) A92(SPI_MISO) A93(GPO0) A94(SPI_CLK) A95(SPI_MOSI) A96(TPM_PP) A97(TYPE10#) A103(LID#) B3(LPC_FRAME#) B4(LPC_AD0) B5(LPC_AD1) B6(LPC_AD2) B7(LPC_AD3) B8(LPC_DRQ0#) B9(LPC_DRQ1#) B10(LPC_CLK) B16(SATA1_TX+) B17(SATA1_TX-) B18(SUS_STAT#) B19(SATA1_RX+) B20(SATA1_RX-) B24(PWR_OK) B27(WDT) B28(AC/HDA_SDIN2) B29(AC/HDA_SDIN1) B30(AC/HDA_SDIN0) B32(SPKR) B33(I2C_CK) B34(I2C_DAT) B35(THRM#) B47(EXCD1_PERST#) B48(EXCD1_CPPE#) B52(RSVD) B53(RSVD) B54(GPO1) B55(RSVD) B56(RSVD) B57(GPO2) B58(PCIE_RX3+) B59(PCIE_RX3-) B61(PCIE_RX2+) B62(PCIE_RX2-) B63(GPO3) B64(PCIE_RX1+) B65(PCIE_RX1-) B67(WAKE1#) B77(DDI0_PAIR4+) B78(DDI0_PAIR4-) B79(LVDC_BKLT_EN) B83(LVDC_BKLT_CTRL) B88(BIOS_DIS1#) B91(DDI0_PAIR5+) B92(DDI0_PAIR5-) B93(DDI0_PAIR6+) B94(DDI0_PAIR6-) B96(USB_HOST_PRSNT) B97(SPI_CS#) B103(SLEEP#)

### Notes on the sheet
- (near J4) CPU Fan
- For BBB
- For WiFi Card
- (near BT1) RTC Battery
- Power OK
- Title
- Size:
- B
- Number:
- Revision:
- Date:
- Sheet
- of

### Library data of the parts
BT1 = CONN-00083: Battery Holder, Coin Cell CR2032, SMD; Manufacturer: Memory Protection Devices; Part Number: CONN-00083; Manufacturer PN: BU2032SM-JJ-GTR; Cost: 1
C30 = CAP-00542: as C1 on sheet SCH1_Power; Part Number: CAP-00542; Capacitance: 0.1uF; Tolerance: ±10%; Voltage Rating: 16V; Type: X7R
D5 D6 = DIO-00057: TVS, Steering (Rail-Rail), 9.8V Clamping, 17A Peak Pulse, SOT-23; Manufacturer: Diodes Incorporated; Manufacturer PN: DLPT05-7-F; Reverse Breakdown Voltage: 6.0V; Part Number: DIO-00057; Type: TVS; Cost: 0.38
D7 D39 = DIO-00001: Dio Shtky, 1A, 0.55V, 40V, SOD-123; Manufacturer: ON Semi; Manufacturer PN: MBR140SFT1G; Forward Voltage: 550mV; Type: Schottky; Part Number: DIO-00001; Reverse Breakdown Voltage: 40V; Current Rating: 1A
D8 = DIO-00049: LED, Blue, 0603, Low current, HELI2 Series; Manufacturer: Kingbright; Manufacturer PN: APT1608LVBC/D; Reverse Breakdown Voltage: 5V; Power Rating: 120mW; Current Rating: 30mA; Part Number: DIO-00049; Type: LED; Cost: 0.58
F7 = MISC-00056: PTC Fuse (Polyfuse), 16V 1.5A Hold, 3A Trip, 300ms; Manufacturer: Littelfuse; Manufacturer PN: 1210L150/16WR; Part Number: MISC-00056; Cost: 1
J3 = CONN-00078: Plug, 220 pos, COM Express Board-Board connector; Manufacturer: TE Connectivity; Positions per level: 110; Levels: 2; Part Number: CONN-00078; Type: Plug; Manufacturer PN: 3-1827253-6; Cost: 18.99
J4 = CONN-00087: Header, 4-Pos, Molex-47053, (CPU Fan Header); Manufacturer: Molex; Manufacturer PN: 0470531000; Positions per level: 4; Levels: 1; Part Number: CONN-00087; Type: Header; Cost: 0.46
J19 = CONN-00008: Header 6x1, 0.1"; Positions per level: 6; Levels: 1; Part Number: CONN-00008
J20 P2 = CONN-00055: Header, 2x1, 0.1"; Manufacturer: Samtec; Manufacturer PN: TSW-102-07-F-S; Positions per level: 2; Levels: 1; Part Number: CONN-00055; Type: Header; Cost: 0.2
Q1 Q2 Q10-Q13 = XSTR-00017: XSTR NMOS, 220mA, 50V, Vgs 1.3V, SOT-23-3; Manufacturer: ON Semi; Max Power: 360mW; Type: NFET; Part Number: XSTR-00017; Max Voltage: 50V; Max Current: 220mA; Vgs/Vce: 1.3V; Cost: 0.31
R13 R14 R16 R18 R133 R134 = RES-00306: as R1 on sheet SCH1_Power; Part Number: RES-00306; Resistance: 10k; Tolerance: 1%; Cost: 0.144
R15 R129 R130 = RES-00360: RES SMD 1K OHM 1% 1/4W 0603; Manufacturer: Panasonic; Manufacturer PN: ERJ-PA3F1001V; Power Rating: 0.25W; Part Number: RES-00360; Resistance: 1k; Tolerance: 1%
R17 R131 R132 = RES-00365: RES SMD 2.2K OHM 1% 1/4W 0603; Manufacturer: Panasonic; Manufacturer PN: ERJ-PA3F2201V; Power Rating: 0.25W; Part Number: RES-00365; Resistance: 2.2k; Tolerance: 1%
R19 R20 = RES-00221: RES SMD 330 OHM 1% 1/4W 0603; Manufacturer: Panasonic; Manufacturer PN: ERJ-PA3F3300V; Power Rating: 0.25W; Part Number: RES-00221; Resistance: 330; Tolerance: 1%
SW1 = MISC-00042: Switch, SPST-NO, Tactile, 6.3x6.0mm, SMD, 50mA 24VDC; Manufacturer: Omron; Manufacturer PN: B3FS-1012P; Part Number: MISC-00042; Cost: 0.71
U5 U51 U52 = LOGIC-00001: Inverter, Dual, sot-23-6, SN74LVC2G04; Manufacturer: TI; Part Number: LOGIC-00001; Manufacturer PN: SN74LVC2G04

## Sheet SCH3_Main_Computer_Eth.SchDoc: Main Computer - Ethernet
size B; Organization: CWRUbotix; Address1: 10900 Euclid Avenue; Address2: Cleveland, OH 44106; Address3: USA; Revision: 1.0; SheetNumber: 3; SheetTotal: 13
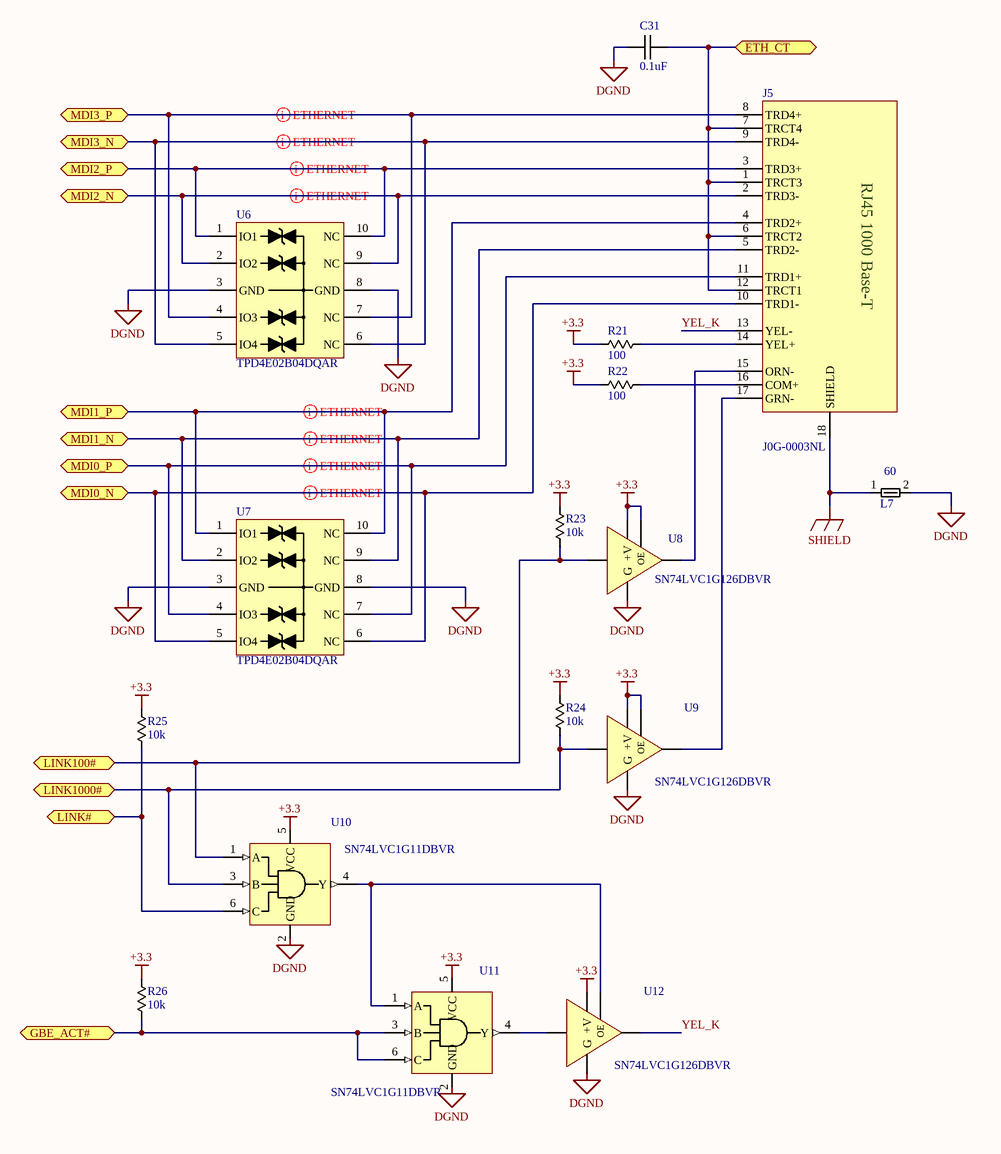
[diagram p2: SCH3_Main_Computer_Eth.SchDoc]

### Parts
C31  0.1uF  [chip_0603]
J5  J0G-0003NL  [J0G-0003NL]
L7  Impedance: 60  [CHIP_0805_FE]  (hidden comment: bead_0)
R21  100  [chip_0603]
R22  100  [chip_0603]
R23  10k  [chip_0603]
R24  10k  [chip_0603]
R25  10k  [chip_0603]
R26  10k  [chip_0603]
U6  TPD4E02B04DQAR  [USON-10]
U7  TPD4E02B04DQAR  [USON-10]
U8  SN74LVC1G126DBVR  [sot-23-5]
U9  SN74LVC1G126DBVR  [sot-23-5]
U10  SN74LVC1G11DBVR  [sot-23-6]
U11  SN74LVC1G11DBVR  [sot-23-6]
U12  SN74LVC1G126DBVR  [sot-23-5]

### Ports
ETH_CT (bidir), GBE_ACT# (bidir), LINK100# (bidir), LINK1000# (bidir), LINK# (bidir), MDI0_N (bidir), MDI0_P (bidir), MDI1_N (bidir), MDI1_P (bidir), MDI2_N (bidir), MDI2_P (bidir), MDI3_N (bidir), MDI3_P (bidir)

### Nets
+3.3: R21.1 R22.1 R23.1 R24.1 R25.1 R26.1 U8.1(OE) U8.5(+V) U9.1(OE) U9.5(+V) U10.5(VCC) U11.5(VCC) U12.5(+V)
DGND: C31.1 L7.2 U6.3(GND) U6.8(GND) U7.3(GND) U7.8(GND) U8.3(G) U9.3(G) U10.2(GND) U11.2(GND) U12.3(G)
SHIELD: J5.18(SHIELD) L7.1
ETH_CT: C31.2 J5.1(TRCT3) J5.6(TRCT2) J5.7(TRCT4) J5.12(TRCT1) ; port ETH_CT
GBE_ACT#: R26.2 U11.3(B) U11.6(C) ; port GBE_ACT#
LINK100#: R23.2 U8.2(A) U10.1(A) ; port LINK100#
LINK1000#: R24.2 U9.2(A) U10.3(B) ; port LINK1000#
LINK#: R25.2 U10.6(C) ; port LINK#
MDI0_N: J5.10(TRD1-) U7.5(IO4) U7.6(NC) ; port MDI0_N
MDI0_P: J5.11(TRD1+) U7.4(IO3) U7.7(NC) ; port MDI0_P
MDI1_N: J5.5(TRD2-) U7.2(IO2) U7.9(NC) ; port MDI1_N
MDI1_P: J5.4(TRD2+) U7.1(IO1) U7.10(NC) ; port MDI1_P
MDI2_N: J5.2(TRD3-) U6.2(IO2) U6.9(NC) ; port MDI2_N
MDI2_P: J5.3(TRD3+) U6.1(IO1) U6.10(NC) ; port MDI2_P
MDI3_N: J5.9(TRD4-) U6.5(IO4) U6.6(NC) ; port MDI3_N
MDI3_P: J5.8(TRD4+) U6.4(IO3) U6.7(NC) ; port MDI3_P
YEL_K: J5.13(YEL-) U12.4(Y)
NetJ5_14: J5.14(YEL+) R21.2
NetJ5_15: J5.15(ORN-) U8.4(Y)
NetJ5_16: J5.16(COM+) R22.2
NetJ5_17: J5.17(GRN-) U9.4(Y)
NetU10_4: U10.4(Y) U11.1(A) U12.1(OE)
NetU11_4: U11.4(Y) U12.2(A)

### Layout directives
differential pair: MDI0_N, MDI0_P, MDI1_N, MDI1_P, MDI2_N, MDI2_P, MDI3_N, MDI3_P

### Notes on the sheet
- Title
- Size:
- B
- Number:
- Revision:
- Date:
- Sheet
- of
- (in symbol CONN-00082) RJ45 1000 Base-T

### Library data of the parts
C31 = CAP-00542: as C1 on sheet SCH1_Power; Part Number: CAP-00542; Capacitance: 0.1uF; Tolerance: ±10%; Voltage Rating: 16V; Type: X7R
J5 = CONN-00082: RJ45 Modular Mag-jack, 8P8C, 1000 Base-T, Horizontal; Manufacturer: Pulse Electronics Network; Positions per level: 8; Levels: 1; Part Number: CONN-00082; Type: Jack; Manufacturer PN: J0G-0003NL; Cost: 10.26
L7 = MAG-00125: Fe Bead, 60 @ 100MH, 3A, 0805; Manufacturer: Pulse Electronics; Manufacturer PN: PE-0805PFB600ST; Test Freq: 100MHz; DCR: 25mOhm; Part Number: MAG-00125; Current Rating: 3A; Cost: 0.1
R21 R22 = RES-00178: RES SMD 100 OHM 1% 1/4W 0603; Manufacturer: Panasonic; Manufacturer PN: ERJ-PA3F1000V; Power Rating: 0.25W; Part Number: RES-00178; Resistance: 100; Tolerance: 1%
R23-R26 = RES-00306: as R1 on sheet SCH1_Power; Part Number: RES-00306; Resistance: 10k; Tolerance: 1%; Cost: 0.144
U6 U7 = DIO-00068: TVS, 4-Ch, ESD Protec, 3.6V 8.8V 10-USON; Manufacturer: TI; Power Rating: 17W; Current Rating: 2A; Part Number: DIO-00068; Type: TVS; Manufacturer PN: TPD4E02B04DQAR; Cost: 0.56
U8 U9 U12 = LOGIC-00040: IC, Tri-State Buffer Non-Inverting, Single, 1.65-5.5V, SOT-23-5; Manufacturer: TI; Part Number: LOGIC-00040; Manufacturer PN: SN74LVC1G126DBVR; Cost: $0.32
U10 U11 = LOGIC-00042: IC, AND Gate, Single 3-Input, 1.65-5.5V, SOT-23-6; Manufacturer: TI; Part Number: LOGIC-00042; Manufacturer PN: SN74LVC1G11DBVR; Cost: $0.37

## Sheet SCH4_Main_Computer_USB.SchDoc: Main Computer - USB 3.0
size B; Organization: CWRUbotix; Address1: 10900 Euclid Avenue; Address2: Cleveland, OH 44106; Address3: USA; Revision: 1.0; SheetNumber: 4; SheetTotal: 13
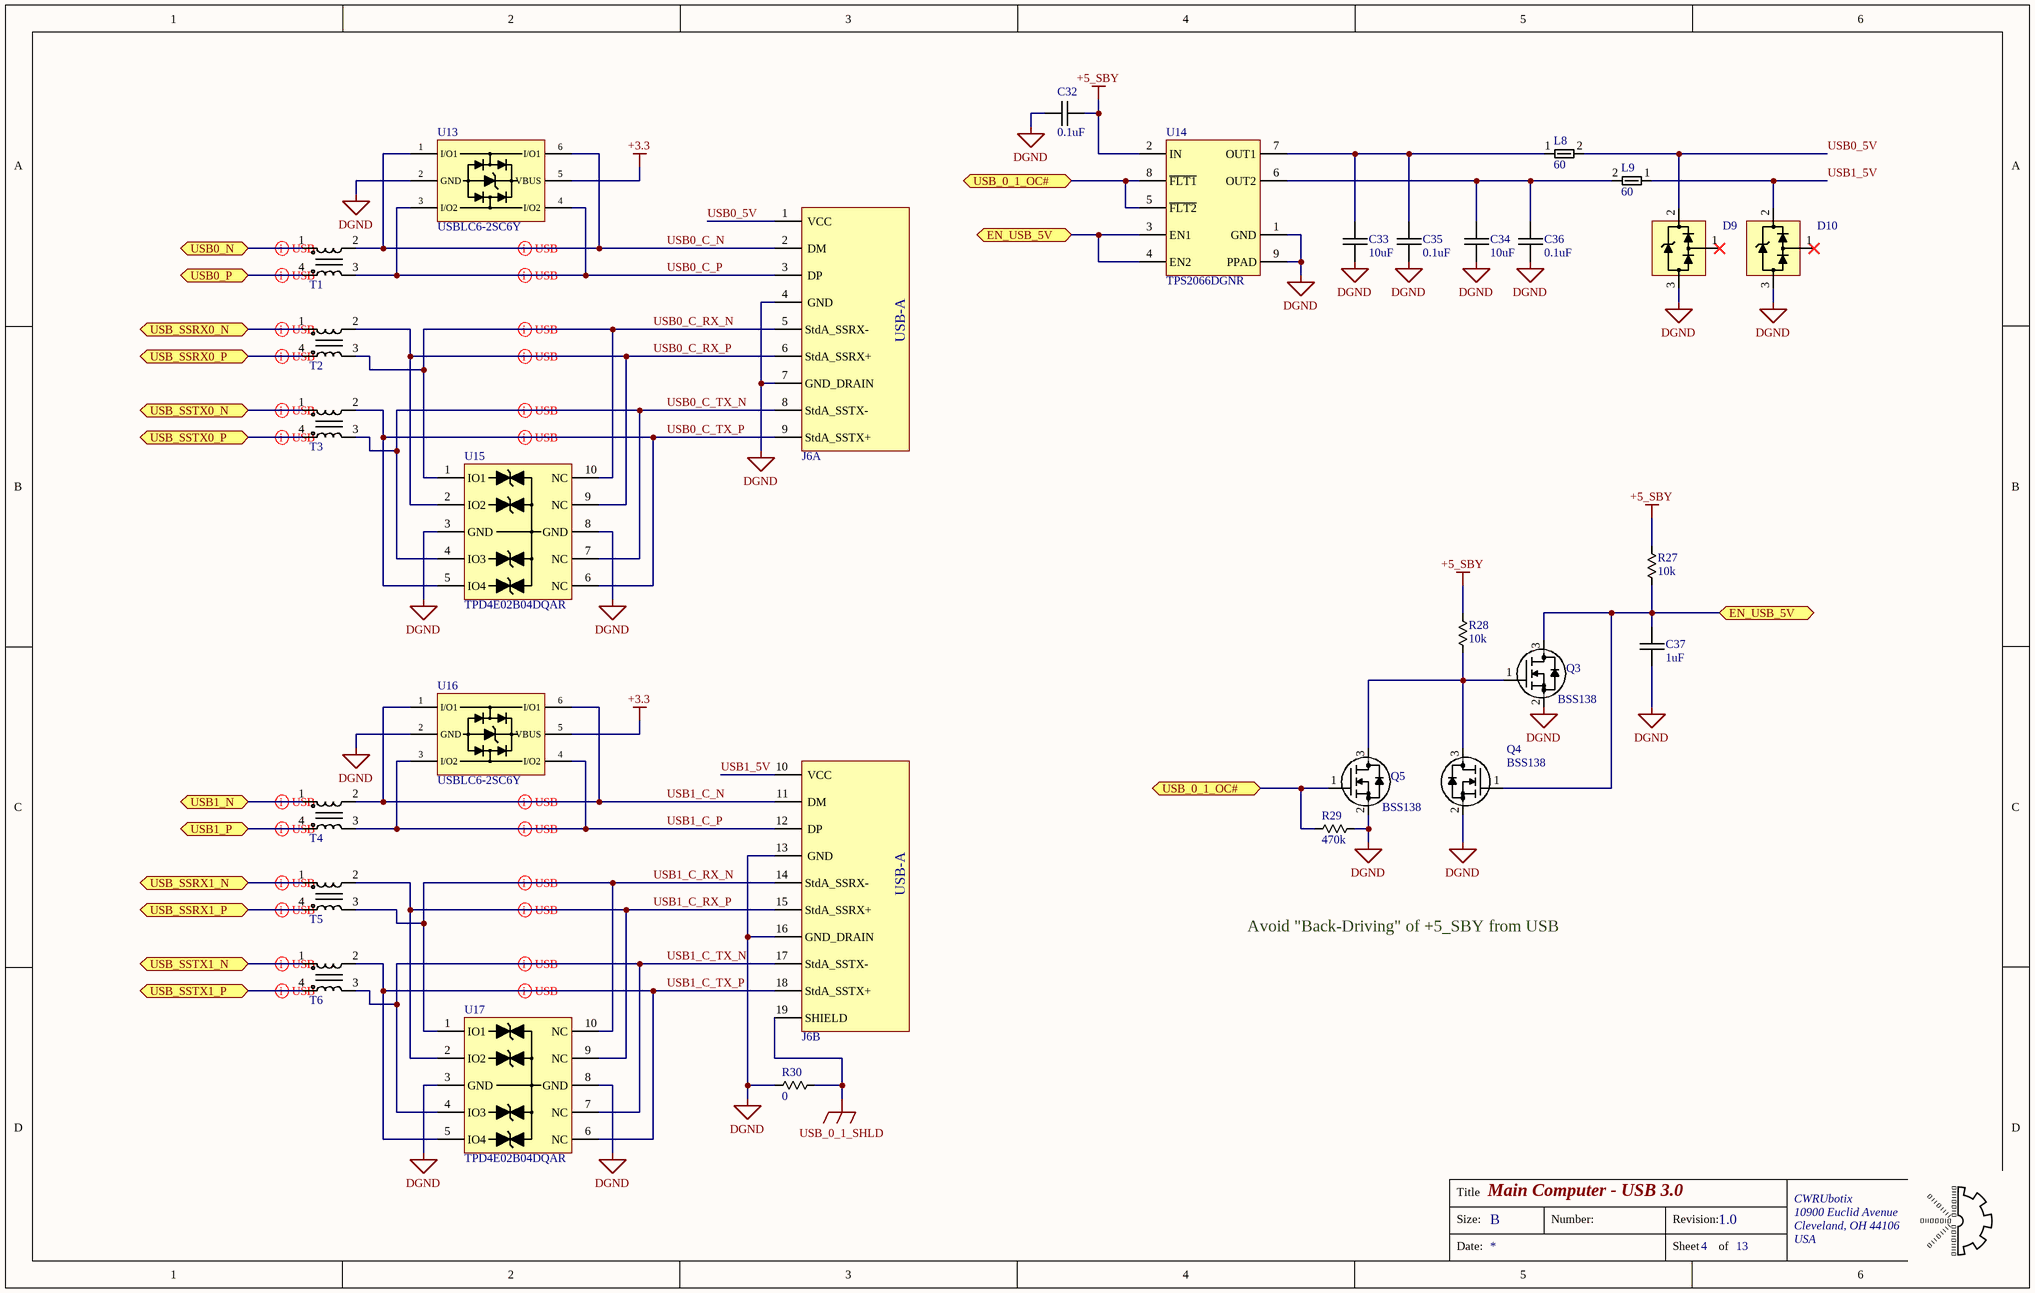
[diagram p3: SCH4_Main_Computer_USB.SchDoc]

### Parts
C32  0.1uF  [chip_0603]
C33  10uF  [chip_1206]
C34  10uF  [chip_1206]
C35  0.1uF  [chip_0603]
C36  0.1uF  [chip_0603]
C37  1uF  [chip_0805]
D9  DLPT05  [sot-23-3]  (value not drawn)
D10  DLPT05  [sot-23-3]  (value not drawn)
J6  1003-004-01010  [CNC_TECH_1003-004-01010]  (value not drawn)  (parts A,B of 2)
L8  Impedance: 60  [CHIP_0805_FE]  (hidden comment: bead_0)
L9  Impedance: 60  [CHIP_0805_FE]  (hidden comment: bead_0)
Q3  Manufacturer PN: BSS138  [sot-23-3]  (hidden comment: n-mosfet_1)
Q4  Manufacturer PN: BSS138  [sot-23-3]  (hidden comment: n-mosfet_1)
Q5  Manufacturer PN: BSS138  [sot-23-3]  (hidden comment: n-mosfet_1)
R27  10k  [chip_0603]
R28  10k  [chip_0603]
R29  470k  [chip_0603]
R30  0  [chip_0805]
T1  DLW21HN900SQ2L  [MURATA_DLW21H]  (value not drawn)
T2  DLW21HN900SQ2L  [MURATA_DLW21H]  (value not drawn)
T3  DLW21HN900SQ2L  [MURATA_DLW21H]  (value not drawn)
T4  DLW21HN900SQ2L  [MURATA_DLW21H]  (value not drawn)
T5  DLW21HN900SQ2L  [MURATA_DLW21H]  (value not drawn)
T6  DLW21HN900SQ2L  [MURATA_DLW21H]  (value not drawn)
U13  USBLC6-2SC6Y  [sot-23-6]
U14  TPS2066DGNR  [VSSOP-8-PPAD]
U15  TPD4E02B04DQAR  [USON-10]
U16  USBLC6-2SC6Y  [sot-23-6]
U17  TPD4E02B04DQAR  [USON-10]

### Ports
EN_USB_5V (bidir), USB0_N (bidir), USB0_P (bidir), USB1_N (bidir), USB1_P (bidir), USB_0_1_OC# (bidir), USB_SSRX0_N (bidir), USB_SSRX0_P (bidir), USB_SSRX1_N (bidir), USB_SSRX1_P (bidir), USB_SSTX0_N (bidir), USB_SSTX0_P (bidir), USB_SSTX1_N (bidir), USB_SSTX1_P (bidir)

### Nets
+3.3: U13.5(VBUS) U16.5(VBUS)
+5_SBY: C32.2 R27.1 R28.1 U14.2(IN)
DGND: C32.1 C33.2 C34.2 C35.1 C36.1 C37.2 D9.3(GND) D10.3(GND) J6.4(GND) J6.7(GND_DRAIN) J6.13(GND) J6.16(GND_DRAIN) Q3.2(S) Q4.2(S) Q5.2(S) R29.2 R30.1 U13.2(GND) U14.1(GND) U14.9(PPAD) U15.3(GND) U15.8(GND) U16.2(GND) U17.3(GND) U17.8(GND)
USB_0_1_SHLD: J6.19(SHIELD) R30.2
EN_USB_5V: C37.1 Q3.3(D) Q4.1(G) R27.2 U14.3(EN1) U14.4(EN2) ; port EN_USB_5V
USB0_5V: D9.2(VCC) J6.1(VCC) L8.2
USB0_C_N: J6.2(DM) T1.2 U13.1(I/O1) U13.6(I/O1)
USB0_C_P: J6.3(DP) T1.3 U13.3(I/O2) U13.4(I/O2)
USB0_C_RX_N: J6.5(StdA_SSRX-) T2.3 U15.1(IO1) U15.10(NC)
USB0_C_RX_P: J6.6(StdA_SSRX+) T2.2 U15.2(IO2) U15.9(NC)
USB0_C_TX_N: J6.8(StdA_SSTX-) T3.3 U15.4(IO3) U15.7(NC)
USB0_C_TX_P: J6.9(StdA_SSTX+) T3.2 U15.5(IO4) U15.6(NC)
USB0_N: T1.1 ; port USB0_N
USB0_P: T1.4 ; port USB0_P
USB1_5V: D10.2(VCC) J6.10(VCC) L9.1
USB1_C_N: J6.11(DM) T4.2 U16.1(I/O1) U16.6(I/O1)
USB1_C_P: J6.12(DP) T4.3 U16.3(I/O2) U16.4(I/O2)
USB1_C_RX_N: J6.14(StdA_SSRX-) T5.3 U17.1(IO1) U17.10(NC)
USB1_C_RX_P: J6.15(StdA_SSRX+) T5.2 U17.2(IO2) U17.9(NC)
USB1_C_TX_N: J6.17(StdA_SSTX-) T6.3 U17.4(IO3) U17.7(NC)
USB1_C_TX_P: J6.18(StdA_SSTX+) T6.2 U17.5(IO4) U17.6(NC)
USB1_N: T4.1 ; port USB1_N
USB1_P: T4.4 ; port USB1_P
USB_0_1_OC#: Q5.1(G) R29.1 U14.5(~{FLT2}) U14.8(~{FLT1}) ; port USB_0_1_OC#
USB_SSRX0_N: T2.1 ; port USB_SSRX0_N
USB_SSRX0_P: T2.4 ; port USB_SSRX0_P
USB_SSRX1_N: T5.1 ; port USB_SSRX1_N
USB_SSRX1_P: T5.4 ; port USB_SSRX1_P
USB_SSTX0_N: T3.1 ; port USB_SSTX0_N
USB_SSTX0_P: T3.4 ; port USB_SSTX0_P
USB_SSTX1_N: T6.1 ; port USB_SSTX1_N
USB_SSTX1_P: T6.4 ; port USB_SSTX1_P
NetC33_1: C33.1 C35.2 L8.1 U14.7(OUT1)
NetC34_1: C34.1 C36.2 L9.2 U14.6(OUT2)
NetQ3_1: Q3.1(G) Q4.3(D) Q5.3(D) R28.2

Not connected (* = marked no-connect by the designer): D9 1(LINE)*; D10 1(LINE)*

### Layout directives
differential pair: USB0_C_N, USB0_C_P, USB0_C_RX_N, USB0_C_RX_P, USB0_C_TX_N, USB0_C_TX_P, USB0_N, USB0_P, USB1_C_N, USB1_C_P, USB1_C_RX_N, USB1_C_RX_P, USB1_C_TX_N, USB1_C_TX_P, USB1_N, USB1_P, USB_SSRX0_N, USB_SSRX0_P, USB_SSRX1_N, USB_SSRX1_P, USB_SSTX0_N, USB_SSTX0_P, USB_SSTX1_N, USB_SSTX1_P

### Notes on the sheet
- Avoid "Back-Driving" of +5_SBY from USB
- Title
- Size:
- B
- Number:
- Revision:
- Date:
- Sheet
- of
- (in symbol CONN-00079, part A) USB-A
- (in symbol CONN-00079, part B) USB-A

### Library data of the parts
C32 C35 C36 = CAP-00542: as C1 on sheet SCH1_Power; Part Number: CAP-00542; Capacitance: 0.1uF; Tolerance: ±10%; Voltage Rating: 16V; Type: X7R
C33 C34 = CAP-00539: as C2 on sheet SCH1_Power; Part Number: CAP-00539; Capacitance: 10uF; Tolerance: ±10%; Voltage Rating: 25V; Type: X7R
C37 = CAP-00110: as C4 on sheet SCH1_Power; Part Number: CAP-00110; Capacitance: 1uF; Tolerance: 10%; Voltage Rating: 16V; Type: X7R
D9 D10 = DIO-00057: as D5 on sheet SCH2_Main_Computer; Part Number: DIO-00057; Type: TVS; Cost: 0.38
J6 = CONN-00079: USB-A Jack x2, USB 3.0, Right-Angle, Thru-Hole; Manufacturer: CNC Tech; Positions per level: 9; Levels: 2; Part Number: CONN-00079; Type: Jack; Manufacturer PN: 1003-004-01010; Cost: 3.55
L8 L9 = MAG-00125: as L7 on sheet SCH3_Main_Computer_Eth; Part Number: MAG-00125; Current Rating: 3A; Cost: 0.1
Q3-Q5 = XSTR-00017: as Q1 on sheet SCH2_Main_Computer; Part Number: XSTR-00017; Max Voltage: 50V; Max Current: 220mA; Vgs/Vce: 1.3V; Cost: 0.31
R27 R28 = RES-00306: as R1 on sheet SCH1_Power; Part Number: RES-00306; Resistance: 10k; Tolerance: 1%; Cost: 0.144
R29 = RES-00489: RES SMD 470K OHM 1% 1/4W 0603; Manufacturer: Panasonic; Manufacturer PN: ERJ-PA3F4703V; Power Rating: 0.25W; Part Number: RES-00489; Resistance: 470k; Tolerance: 1%
R30 = RES-00720: as R125 on sheet SCH1_Power; Part Number: RES-00720; Resistance: 0; Power Rating: 1/8W; Cost: 0.1
T1-T6 = MAG-00121: CMC, 330mA 2-CH 90 OHM @ 100MHz SMD; Manufacturer: Murata; Impedance: 90; DCR: 350mOhm; Part Number: MAG-00121; Test Freq: 100MHz; Manufacturer PN: DLW21HN900SQ2L; Cost: 0.53
U13 U16 = DIO-00069: ESD Protec, 2-Ch, 2.5pF, 17V clamping voltage, SOT23-6; Manufacturer: ST; Forward Voltage: 1.1V; Reverse Breakdown Voltage: 6V; Current Rating: 5A; Part Number: DIO-00069; Type: TVS; Manufacturer PN: USBLC6-2SC6Y; Cost: 0.73
U14 = PWREG-00052: IC, Power Switch 1:2, 8-MSOP; Manufacturer: TI; Voltage Range In: 2.7 ~ 5.5V; Max Current: 1A; Part Number: PWREG-00052; Voltage Range Out: 2.7 ~ 5.5V; Reg Type: Power Switch; Manufacturer PN: TPS2066DGNR; Cost: 1.56
U15 U17 = DIO-00068: as U6 on sheet SCH3_Main_Computer_Eth; Part Number: DIO-00068; Type: TVS; Manufacturer PN: TPD4E02B04DQAR; Cost: 0.56

## Sheet SCH5_Main_computer_USB2-0.SchDoc: Main Computer - USB 2.0
size B; Organization: CWRUbotix; Address1: 10900 Euclid Avenue; Address2: Cleveland, OH 44106; Address3: USA; Revision: 1.0; SheetNumber: 5; SheetTotal: 13
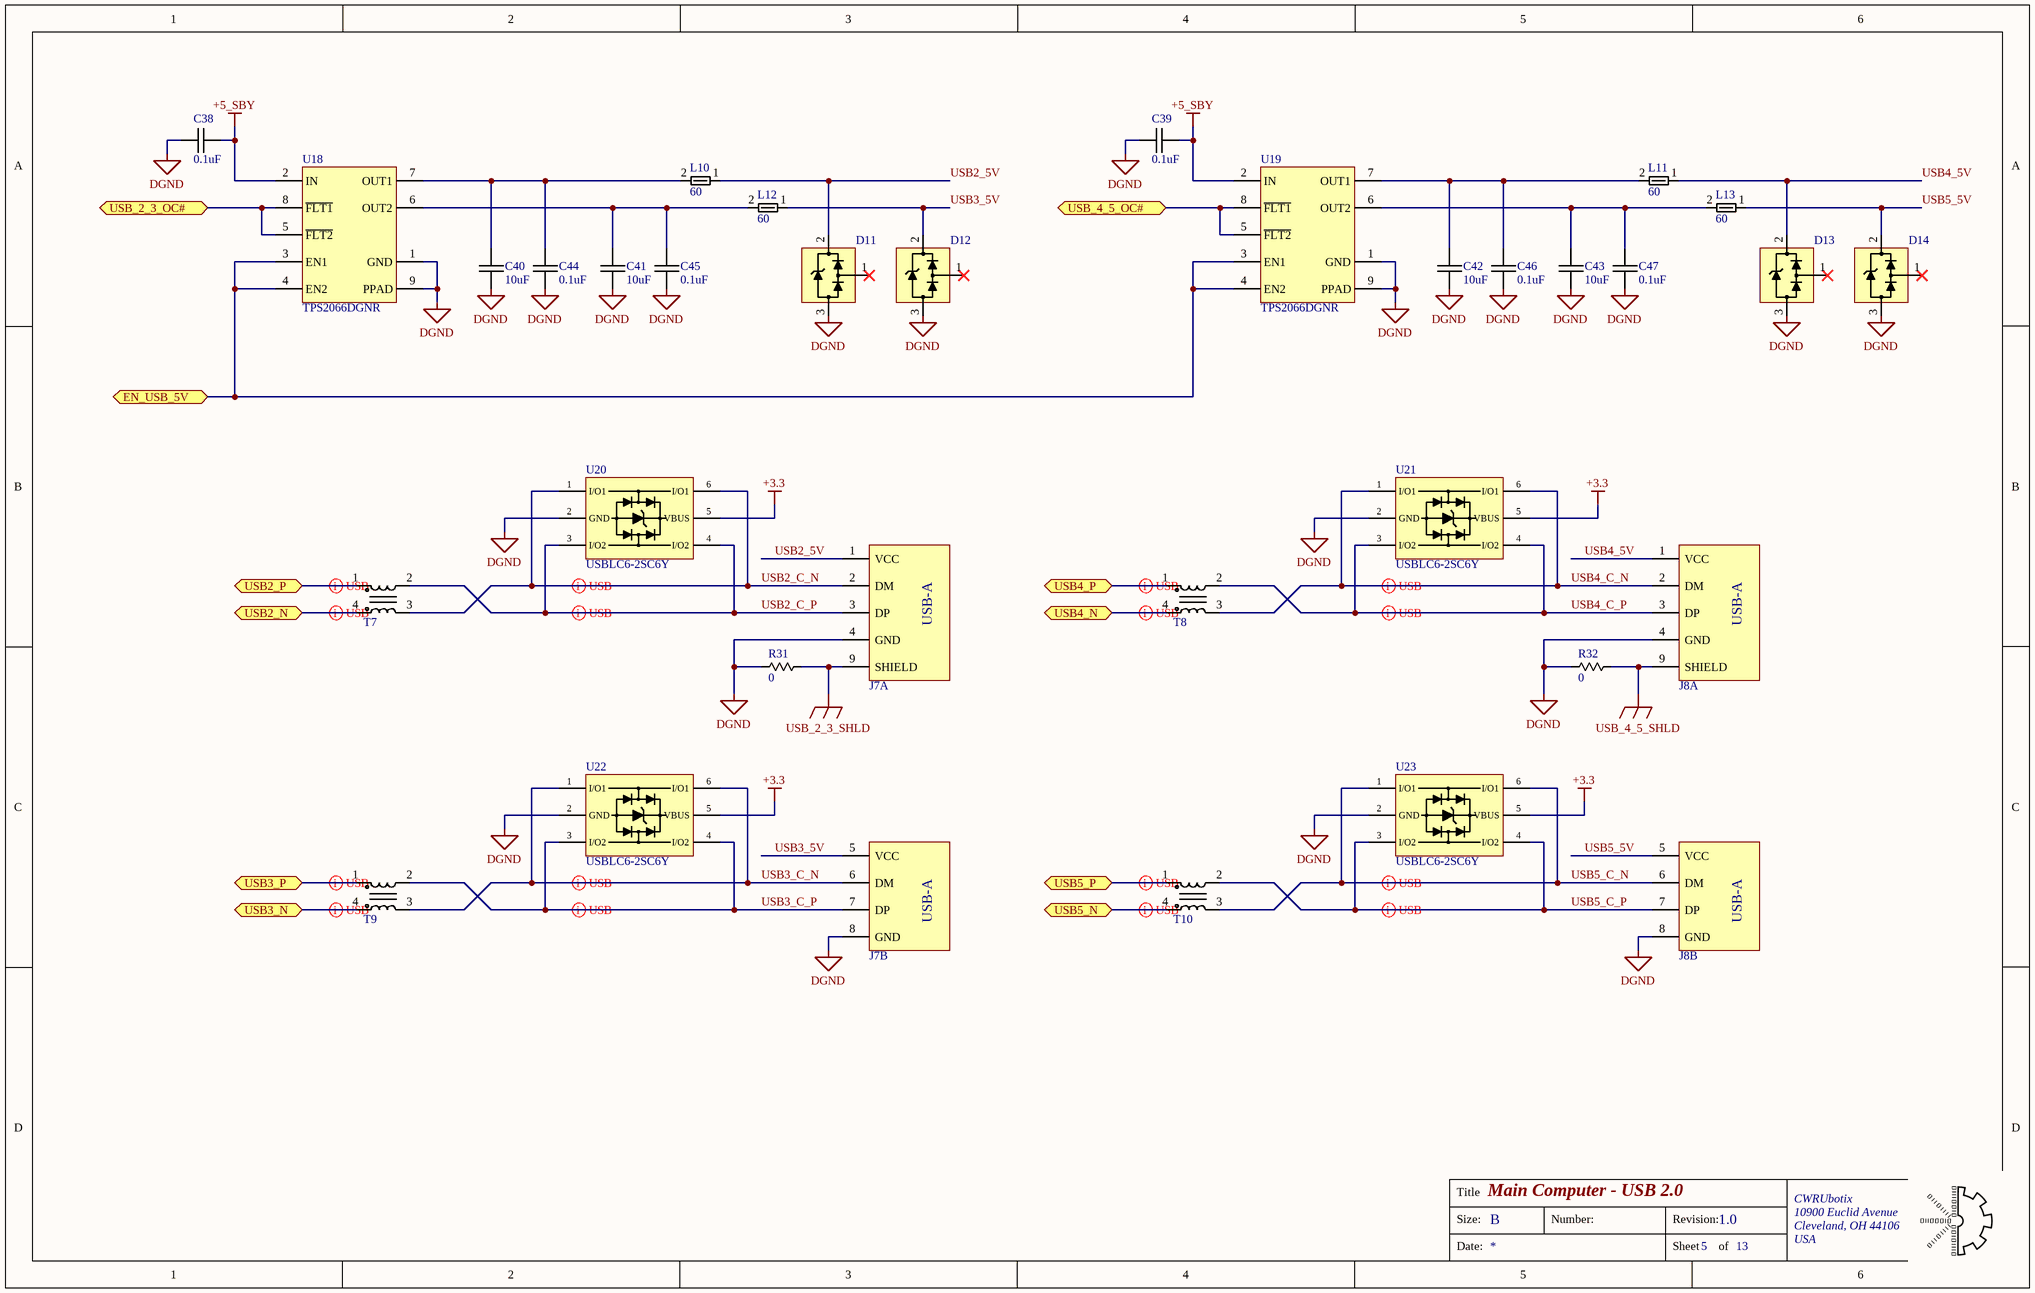
[diagram p4: SCH5_Main_computer_USB2-0.SchDoc]

### Parts
C38  0.1uF  [chip_0603]
C39  0.1uF  [chip_0603]
C40  10uF  [chip_1206]
C41  10uF  [chip_1206]
C42  10uF  [chip_1206]
C43  10uF  [chip_1206]
C44  0.1uF  [chip_0603]
C45  0.1uF  [chip_0603]
C46  0.1uF  [chip_0603]
C47  0.1uF  [chip_0603]
D11  DLPT05  [sot-23-3]  (value not drawn)
D12  DLPT05  [sot-23-3]  (value not drawn)
D13  DLPT05  [sot-23-3]  (value not drawn)
D14  DLPT05  [sot-23-3]  (value not drawn)
J7  usb_a_x2  [CUI_UJ2-ADH-1-TH]  (value not drawn)  (parts A,B of 2)
J8  usb_a_x2  [CUI_UJ2-ADH-1-TH]  (value not drawn)  (parts A,B of 2)
L10  Impedance: 60  [CHIP_0805_FE]  (hidden comment: bead_0)
L11  Impedance: 60  [CHIP_0805_FE]  (hidden comment: bead_0)
L12  Impedance: 60  [CHIP_0805_FE]  (hidden comment: bead_0)
L13  Impedance: 60  [CHIP_0805_FE]  (hidden comment: bead_0)
R31  0  [chip_0805]
R32  0  [chip_0805]
T7  DLW21HN900SQ2L  [MURATA_DLW21H]  (value not drawn)
T8  DLW21HN900SQ2L  [MURATA_DLW21H]  (value not drawn)
T9  DLW21HN900SQ2L  [MURATA_DLW21H]  (value not drawn)
T10  DLW21HN900SQ2L  [MURATA_DLW21H]  (value not drawn)
U18  TPS2066DGNR  [VSSOP-8-PPAD]
U19  TPS2066DGNR  [VSSOP-8-PPAD]
U20  USBLC6-2SC6Y  [sot-23-6]
U21  USBLC6-2SC6Y  [sot-23-6]
U22  USBLC6-2SC6Y  [sot-23-6]
U23  USBLC6-2SC6Y  [sot-23-6]

### Ports
EN_USB_5V (bidir), USB2_N (bidir), USB2_P (bidir), USB3_N (bidir), USB3_P (bidir), USB4_N (bidir), USB4_P (bidir), USB5_N (bidir), USB5_P (bidir), USB_2_3_OC# (bidir), USB_4_5_OC# (bidir)

### Nets
+3.3: U20.5(VBUS) U21.5(VBUS) U22.5(VBUS) U23.5(VBUS)
+5_SBY: C38.2 C39.2 U18.2(IN) U19.2(IN)
DGND: C38.1 C39.1 C40.2 C41.2 C42.2 C43.2 C44.1 C45.1 C46.1 C47.1 D11.3(GND) D12.3(GND) D13.3(GND) D14.3(GND) J7.4(GND) J7.8(GND) J8.4(GND) J8.8(GND) R31.1 R32.1 U18.1(GND) U18.9(PPAD) U19.1(GND) U19.9(PPAD) U20.2(GND) U21.2(GND) U22.2(GND) U23.2(GND)
USB_2_3_SHLD: J7.9(SHIELD) R31.2
USB_4_5_SHLD: J8.9(SHIELD) R32.2
EN_USB_5V: U18.3(EN1) U18.4(EN2) U19.3(EN1) U19.4(EN2) ; port EN_USB_5V
USB2_5V: D11.2(VCC) J7.1(VCC) L10.1
USB2_C_N: J7.2(DM) T7.3 U20.1(I/O1) U20.6(I/O1)
USB2_C_P: J7.3(DP) T7.2 U20.3(I/O2) U20.4(I/O2)
USB2_N: T7.4 ; port USB2_N
USB2_P: T7.1 ; port USB2_P
USB3_5V: D12.2(VCC) J7.5(VCC) L12.1
USB3_C_N: J7.6(DM) T9.3 U22.1(I/O1) U22.6(I/O1)
USB3_C_P: J7.7(DP) T9.2 U22.3(I/O2) U22.4(I/O2)
USB3_N: T9.4 ; port USB3_N
USB3_P: T9.1 ; port USB3_P
USB4_5V: D13.2(VCC) J8.1(VCC) L11.1
USB4_C_N: J8.2(DM) T8.3 U21.1(I/O1) U21.6(I/O1)
USB4_C_P: J8.3(DP) T8.2 U21.3(I/O2) U21.4(I/O2)
USB4_N: T8.4 ; port USB4_N
USB4_P: T8.1 ; port USB4_P
USB5_5V: D14.2(VCC) J8.5(VCC) L13.1
USB5_C_N: J8.6(DM) T10.3 U23.1(I/O1) U23.6(I/O1)
USB5_C_P: J8.7(DP) T10.2 U23.3(I/O2) U23.4(I/O2)
USB5_N: T10.4 ; port USB5_N
USB5_P: T10.1 ; port USB5_P
USB_2_3_OC#: U18.5(~{FLT2}) U18.8(~{FLT1}) ; port USB_2_3_OC#
USB_4_5_OC#: U19.5(~{FLT2}) U19.8(~{FLT1}) ; port USB_4_5_OC#
NetC40_1: C40.1 C44.2 L10.2 U18.7(OUT1)
NetC41_1: C41.1 C45.2 L12.2 U18.6(OUT2)
NetC42_1: C42.1 C46.2 L11.2 U19.7(OUT1)
NetC43_1: C43.1 C47.2 L13.2 U19.6(OUT2)

Not connected (* = marked no-connect by the designer): D11 1(LINE)*; D12 1(LINE)*; D13 1(LINE)*; D14 1(LINE)*

### Layout directives
differential pair: USB2_C_N, USB2_C_P, USB2_N, USB2_P, USB3_C_N, USB3_C_P, USB3_N, USB3_P, USB4_C_N, USB4_C_P, USB4_N, USB4_P, USB5_C_N, USB5_C_P, USB5_N, USB5_P

### Notes on the sheet
- Title
- Size:
- B
- Number:
- Revision:
- Date:
- Sheet
- of
- (in symbol CONN-00068, part A) USB-A
- (in symbol CONN-00068, part B) USB-A

### Library data of the parts
C38 C39 C44-C47 = CAP-00542: as C1 on sheet SCH1_Power; Part Number: CAP-00542; Capacitance: 0.1uF; Tolerance: ±10%; Voltage Rating: 16V; Type: X7R
C40-C43 = CAP-00539: as C2 on sheet SCH1_Power; Part Number: CAP-00539; Capacitance: 10uF; Tolerance: ±10%; Voltage Rating: 25V; Type: X7R
D11-D14 = DIO-00057: as D5 on sheet SCH2_Main_Computer; Part Number: DIO-00057; Type: TVS; Cost: 0.38
J7 J8 = CONN-00068: USB-A Jack x2, USB 2.0, Right-Angle, Thru-Hole; Manufacturer: CUI; Manufacturer PN: UJ2-ADH-1-TH; Positions per level: 4; Levels: 2; Part Number: CONN-00068; Type: Jack; Cost: 0.95
L10-L13 = MAG-00125: as L7 on sheet SCH3_Main_Computer_Eth; Part Number: MAG-00125; Current Rating: 3A; Cost: 0.1
R31 R32 = RES-00720: as R125 on sheet SCH1_Power; Part Number: RES-00720; Resistance: 0; Power Rating: 1/8W; Cost: 0.1
T7-T10 = MAG-00121: as T1 on sheet SCH4_Main_Computer_USB; Part Number: MAG-00121; Test Freq: 100MHz; Manufacturer PN: DLW21HN900SQ2L; Cost: 0.53
U18 U19 = PWREG-00052: as U14 on sheet SCH4_Main_Computer_USB; Part Number: PWREG-00052; Voltage Range Out: 2.7 ~ 5.5V; Reg Type: Power Switch; Manufacturer PN: TPS2066DGNR; Cost: 1.56
U20-U23 = DIO-00069: as U13 on sheet SCH4_Main_Computer_USB; Part Number: DIO-00069; Type: TVS; Manufacturer PN: USBLC6-2SC6Y; Cost: 0.73

## Sheet SCH6_Main_computer_Display.SchDoc: Main Computer - Display
size B; Organization: CWRUbotix; Address1: 10900 Euclid Avenue; Address2: Cleveland, OH 44106; Address3: USA; Revision: 1.0; SheetNumber: 6; SheetTotal: 13
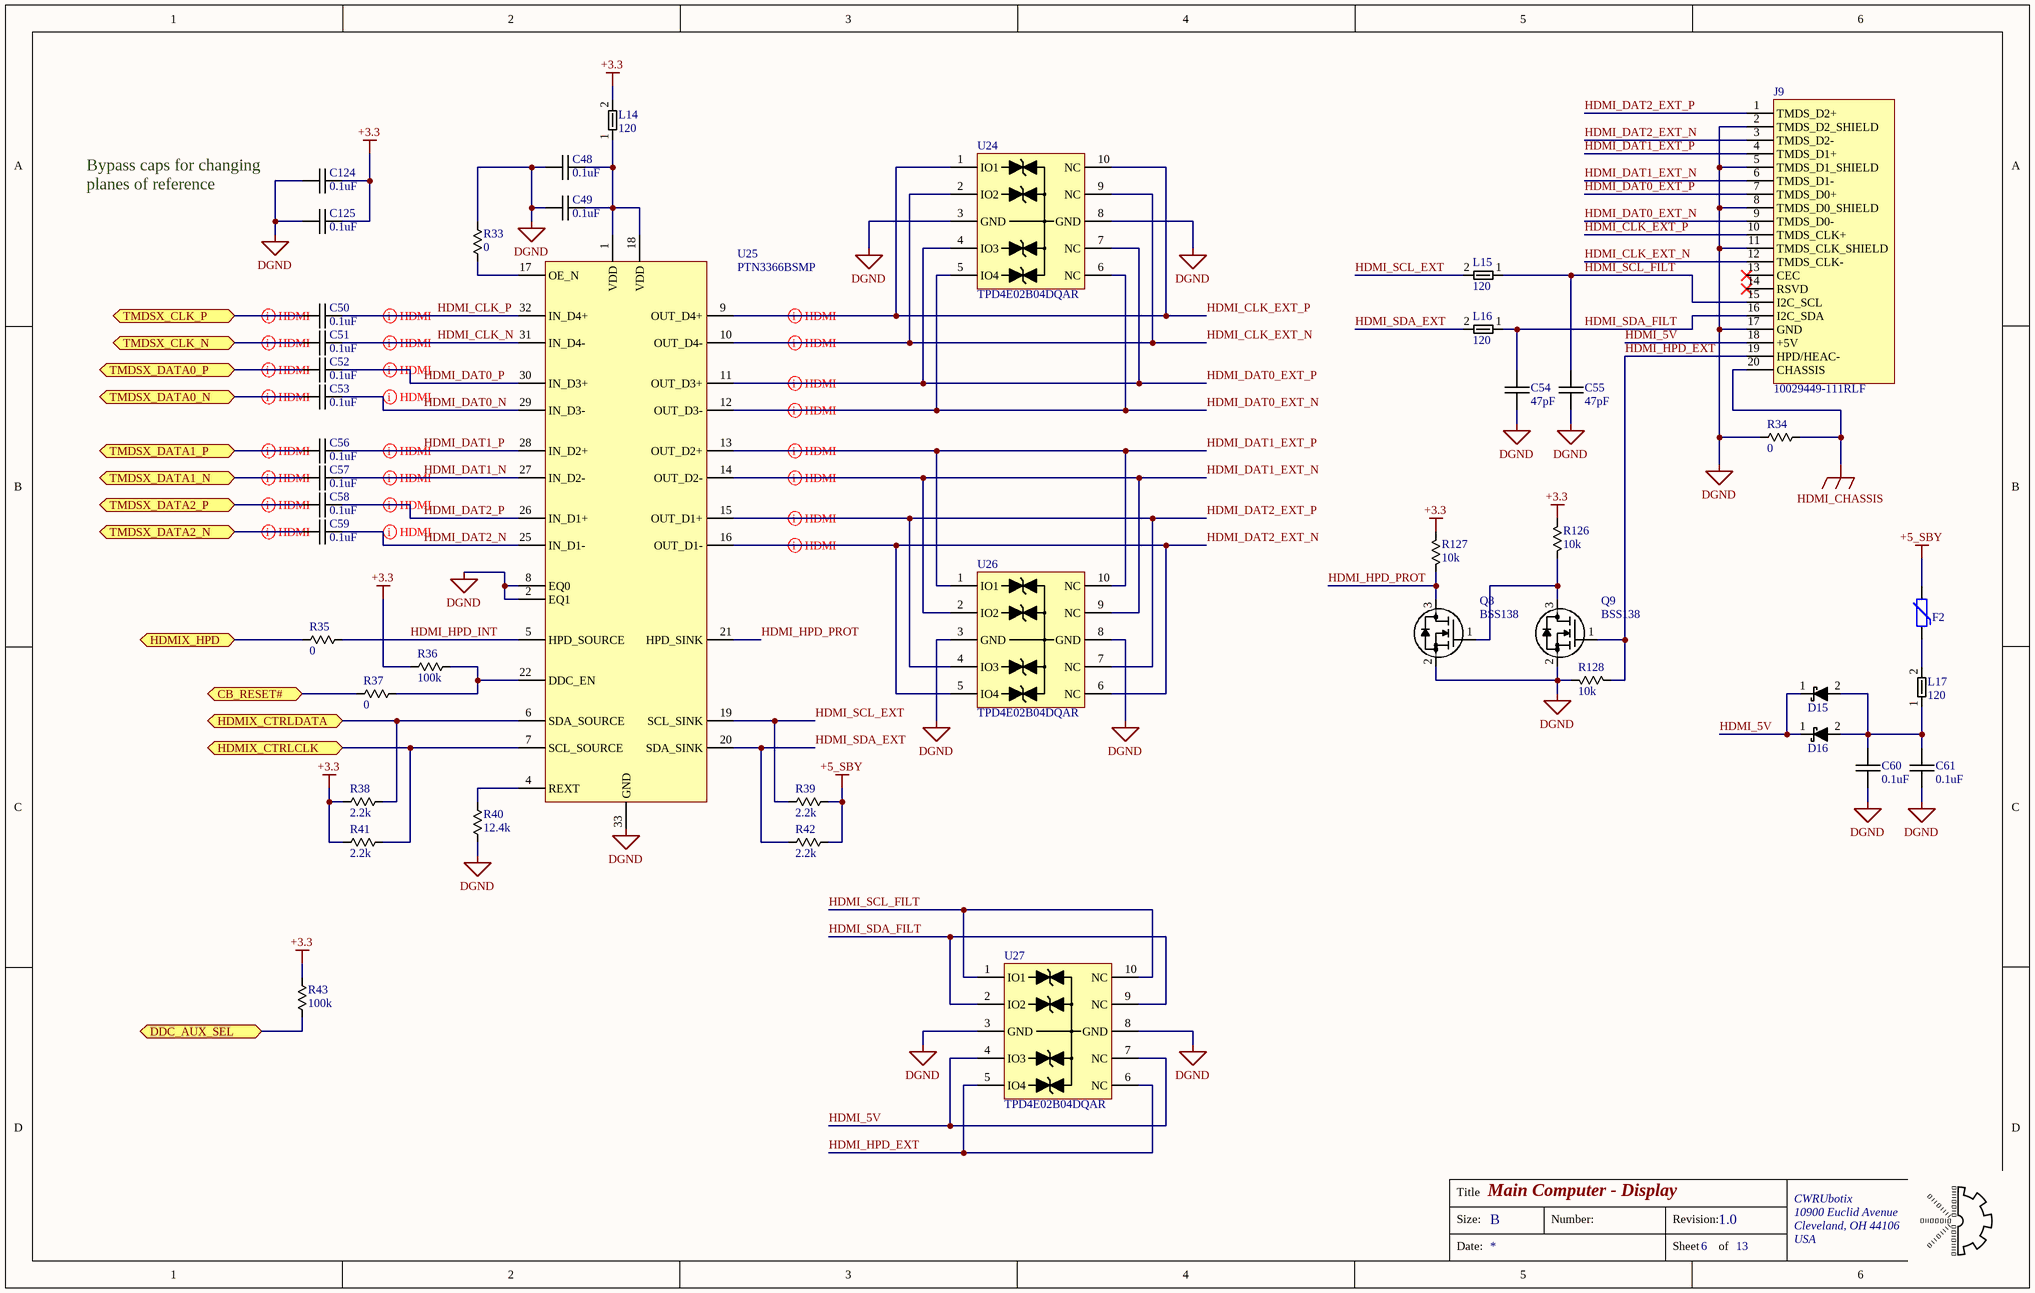
[diagram p5: SCH6_Main_computer_Display.SchDoc]

### Parts
C48  0.1uF  [chip_0603]
C49  0.1uF  [chip_0603]
C50  0.1uF  [chip_0603]
C51  0.1uF  [chip_0603]
C52  0.1uF  [chip_0603]
C53  0.1uF  [chip_0603]
C54  47pF  [chip_0603]
C55  47pF  [chip_0603]
C56  0.1uF  [chip_0603]
C57  0.1uF  [chip_0603]
C58  0.1uF  [chip_0603]
C59  0.1uF  [chip_0603]
C60  0.1uF  [chip_0603]
C61  0.1uF  [chip_0603]
C124  0.1uF  [chip_0603]
C125  0.1uF  [chip_0603]
D15  diode_2  [sod123_0]  (value not drawn)
D16  diode_2  [sod123_0]  (value not drawn)
F2  PTC_0  [chip_1210]  (value not drawn)
J9  10029449-111RLF  [AMPHENOL_10029449]
L14  Impedance: 120  [CHIP_0603_FE]  (hidden comment: bead_0)
L15  Impedance: 120  [CHIP_0603_FE]  (hidden comment: bead_0)
L16  Impedance: 120  [CHIP_0603_FE]  (hidden comment: bead_0)
L17  Impedance: 120  [CHIP_0603_FE]  (hidden comment: bead_0)
Q8  Manufacturer PN: BSS138  [sot-23-3]  (hidden comment: n-mosfet_1)
Q9  Manufacturer PN: BSS138  [sot-23-3]  (hidden comment: n-mosfet_1)
R33  0  [chip_0805]
R34  0  [chip_0805]
R35  0  [chip_0805]
R36  100k  [chip_0603]
R37  0  [chip_0805]
R38  2.2k  [chip_0603]
R39  2.2k  [chip_0603]
R40  12.4k  [chip_0603]
R41  2.2k  [chip_0603]
R42  2.2k  [chip_0603]
R43  100k  [chip_0603]
R126  10k  [chip_0603]
R127  10k  [chip_0603]
R128  10k  [chip_0603]
U24  TPD4E02B04DQAR  [USON-10]
U25  PTN3366BSMP  [HVQFN-32]
U26  TPD4E02B04DQAR  [USON-10]
U27  TPD4E02B04DQAR  [USON-10]

### Ports
CB_RESET# (bidir), DDC_AUX_SEL (bidir), HDMIX_CTRLCLK (bidir), HDMIX_CTRLDATA (bidir), HDMIX_HPD (bidir), TMDSX_CLK_N (bidir), TMDSX_CLK_P (bidir), TMDSX_DATA0_N (bidir), TMDSX_DATA0_P (bidir), TMDSX_DATA1_N (bidir), TMDSX_DATA1_P (bidir), TMDSX_DATA2_N (bidir), TMDSX_DATA2_P (bidir)

### Nets
+3.3: C124.2 C125.2 L14.2 R36.1 R38.1 R41.1 R43.2 R126.1 R127.1
+5_SBY: F2.2 R39.2 R42.2
DGND: C48.1 C49.1 C54.2 C55.2 C60.1 C61.1 C124.1 C125.1 J9.2(TMDS_D2_SHIELD) J9.5(TMDS_D1_SHIELD) J9.8(TMDS_D0_SHIELD) J9.11(TMDS_CLK_SHIELD) J9.17(GND) Q8.2(S) Q9.2(S) R33.2 R34.2 R40.2 R128.2 U24.3(GND) U24.8(GND) U25.2(EQ1) U25.8(EQ0) U25.33(GND) U26.3(GND) U26.8(GND) U27.3(GND) U27.8(GND)
HDMI_CHASSIS: J9.20(CHASSIS) R34.1
CB_RESET#: R37.1 ; port CB_RESET#
DDC_AUX_SEL: R43.1 ; port DDC_AUX_SEL
HDMI_5V: D15.1 D16.1 J9.18(+5V) U27.4(IO3) U27.7(NC)
HDMI_CLK_EXT_N: J9.12(TMDS_CLK-) U24.2(IO2) U24.9(NC) U25.10(OUT_D4-)
HDMI_CLK_EXT_P: J9.10(TMDS_CLK+) U24.1(IO1) U24.10(NC) U25.9(OUT_D4+)
HDMI_CLK_N: C51.2 U25.31(IN_D4-)
HDMI_CLK_P: C50.2 U25.32(IN_D4+)
HDMI_DAT0_EXT_N: J9.9(TMDS_D0-) U24.5(IO4) U24.6(NC) U25.12(OUT_D3-)
HDMI_DAT0_EXT_P: J9.7(TMDS_D0+) U24.4(IO3) U24.7(NC) U25.11(OUT_D3+)
HDMI_DAT0_N: C53.2 U25.29(IN_D3-)
HDMI_DAT0_P: C52.2 U25.30(IN_D3+)
HDMI_DAT1_EXT_N: J9.6(TMDS_D1-) U25.14(OUT_D2-) U26.2(IO2) U26.9(NC)
HDMI_DAT1_EXT_P: J9.4(TMDS_D1+) U25.13(OUT_D2+) U26.1(IO1) U26.10(NC)
HDMI_DAT1_N: C57.2 U25.27(IN_D2-)
HDMI_DAT1_P: C56.2 U25.28(IN_D2+)
HDMI_DAT2_EXT_N: J9.3(TMDS_D2-) U25.16(OUT_D1-) U26.5(IO4) U26.6(NC)
HDMI_DAT2_EXT_P: J9.1(TMDS_D2+) U25.15(OUT_D1+) U26.4(IO3) U26.7(NC)
HDMI_DAT2_N: C59.2 U25.25(IN_D1-)
HDMI_DAT2_P: C58.2 U25.26(IN_D1+)
HDMI_HPD_EXT: J9.19(HPD/HEAC-) Q9.1(G) R128.1 U27.5(IO4) U27.6(NC)
HDMI_HPD_INT: R35.1 U25.5(HPD_SOURCE)
HDMI_HPD_PROT: Q8.3(D) R127.2 U25.21(HPD_SINK)
HDMI_SCL_EXT: L15.2 R39.1 U25.19(SCL_SINK)
HDMI_SCL_FILT: C55.1 J9.15(I2C_SCL) L15.1 U27.1(IO1) U27.10(NC)
HDMI_SDA_EXT: L16.2 R42.1 U25.20(SDA_SINK)
HDMI_SDA_FILT: C54.1 J9.16(I2C_SDA) L16.1 U27.2(IO2) U27.9(NC)
HDMIX_CTRLCLK: R41.2 U25.7(SCL_SOURCE) ; port HDMIX_CTRLCLK
HDMIX_CTRLDATA: R38.2 U25.6(SDA_SOURCE) ; port HDMIX_CTRLDATA
HDMIX_HPD: R35.2 ; port HDMIX_HPD
TMDSX_CLK_N: C51.1 ; port TMDSX_CLK_N
TMDSX_CLK_P: C50.1 ; port TMDSX_CLK_P
TMDSX_DATA0_N: C53.1 ; port TMDSX_DATA0_N
TMDSX_DATA0_P: C52.1 ; port TMDSX_DATA0_P
TMDSX_DATA1_N: C57.1 ; port TMDSX_DATA1_N
TMDSX_DATA1_P: C56.1 ; port TMDSX_DATA1_P
TMDSX_DATA2_N: C59.1 ; port TMDSX_DATA2_N
TMDSX_DATA2_P: C58.1 ; port TMDSX_DATA2_P
NetC48_2: C48.2 C49.2 L14.1 U25.1(VDD) U25.18(VDD)
NetC60_2: C60.2 C61.2 D15.2 D16.2 L17.1
NetF2_1: F2.1 L17.2
NetQ8_1: Q8.1(G) Q9.3(D) R126.2
NetR33_1: R33.1 U25.17(OE_N)
NetR36_2: R36.2 R37.2 U25.22(DDC_EN)
NetR40_1: R40.1 U25.4(REXT)

Not connected (* = marked no-connect by the designer): J9 13(CEC)* 14(RSVD)*; U25 3(NC) 23(NC) 24(NC)

### Layout directives
differential pair: HDMI_CLK_EXT_N, HDMI_CLK_EXT_P, HDMI_CLK_N, HDMI_CLK_P, HDMI_DAT0_EXT_N, HDMI_DAT0_EXT_P, HDMI_DAT0_N, HDMI_DAT0_P, HDMI_DAT1_EXT_N, HDMI_DAT1_EXT_P, HDMI_DAT1_N, HDMI_DAT1_P, HDMI_DAT2_EXT_N, HDMI_DAT2_EXT_P, HDMI_DAT2_N, HDMI_DAT2_P, TMDSX_CLK_N, TMDSX_CLK_P, TMDSX_DATA0_N, TMDSX_DATA0_P, TMDSX_DATA1_N, TMDSX_DATA1_P, TMDSX_DATA2_N, TMDSX_DATA2_P

### Notes on the sheet
- Bypass caps for changing planes of reference
- Title
- Size:
- B
- Number:
- Revision:
- Date:
- Sheet
- of

### Library data of the parts
C48-C53 C56-C61 C124 C125 = CAP-00542: as C1 on sheet SCH1_Power; Part Number: CAP-00542; Capacitance: 0.1uF; Tolerance: ±10%; Voltage Rating: 16V; Type: X7R
C54 C55 = CAP-00406: CAP, 47pF, ±2%, 50V, C0G, 0603; Manufacturer: Murata; Manufacturer PN: GRM1885C1H470GA01J; Part Number: CAP-00406; Capacitance: 47pF; Tolerance: ±2%; Voltage Rating: 50V; Type: C0G
D15 D16 = DIO-00001: as D7 on sheet SCH2_Main_Computer; Part Number: DIO-00001; Reverse Breakdown Voltage: 40V; Current Rating: 1A
F2 = MISC-00056: as F7 on sheet SCH2_Main_Computer; Part Number: MISC-00056; Cost: 1
J9 = CONN-00080: HDMI Type A Jack, Right-Angle, SMD+Thru-Hole; Manufacturer: Amphenol; Positions per level: 19; Levels: 1; Current: 0.5; Part Number: CONN-00080; Type: Jack; Manufacturer PN: 10029449-111RLF; Cost: 0.8
L14-L17 = MAG-00126: Fe Bead, 120 @ 100MHz, 800mA, 0603; Manufacturer: Murata; Manufacturer PN: BLM18AG121SN1D; DCR: 180mOhm; Part Number: MAG-00126; Current Rating: 800mA; Test Freq: 100MHz; Cost: 0.1
Q8 Q9 = XSTR-00017: as Q1 on sheet SCH2_Main_Computer; Part Number: XSTR-00017; Max Voltage: 50V; Max Current: 220mA; Vgs/Vce: 1.3V; Cost: 0.31
R33-R35 R37 = RES-00720: as R125 on sheet SCH1_Power; Part Number: RES-00720; Resistance: 0; Power Rating: 1/8W; Cost: 0.1
R36 R43 = RES-00301: RES SMD 100K OHM 1% 1/4W 0603; Manufacturer: Panasonic; Manufacturer PN: ERJ-PA3F1003V; Power Rating: 0.25W; Part Number: RES-00301; Resistance: 100k; Tolerance: 1%
R38 R39 R41 R42 = RES-00365: as R17 on sheet SCH2_Main_Computer; Part Number: RES-00365; Resistance: 2.2k; Tolerance: 1%
R40 = RES-00721: RES SMD 12.4K OHM 1% 1/10W 0603; Manufacturer: Stackpole; Manufacturer PN: RMCF0603FT12K4; Part Number: RES-00721; Resistance: 12.4k; Tolerance: 1%; Power Rating: 1/10W; Cost: 0.1
R126-R128 = RES-00306: as R1 on sheet SCH1_Power; Part Number: RES-00306; Resistance: 10k; Tolerance: 1%; Cost: 0.144
U24 U26 U27 = DIO-00068: as U6 on sheet SCH3_Main_Computer_Eth; Part Number: DIO-00068; Type: TVS; Manufacturer PN: TPD4E02B04DQAR; Cost: 0.56
U25 = IFACE-00026: IC, Video Level Shifter, HDMI v1.4b, 32-HVQFN, PTN3366; Manufacturer: NXP; Part Number: IFACE-00026; Manufacturer PN: PTN3366BSMP; Cost: 0.94